# EAGLE schematic dsp_board_dds_vga (EAGLE 9.6.2)
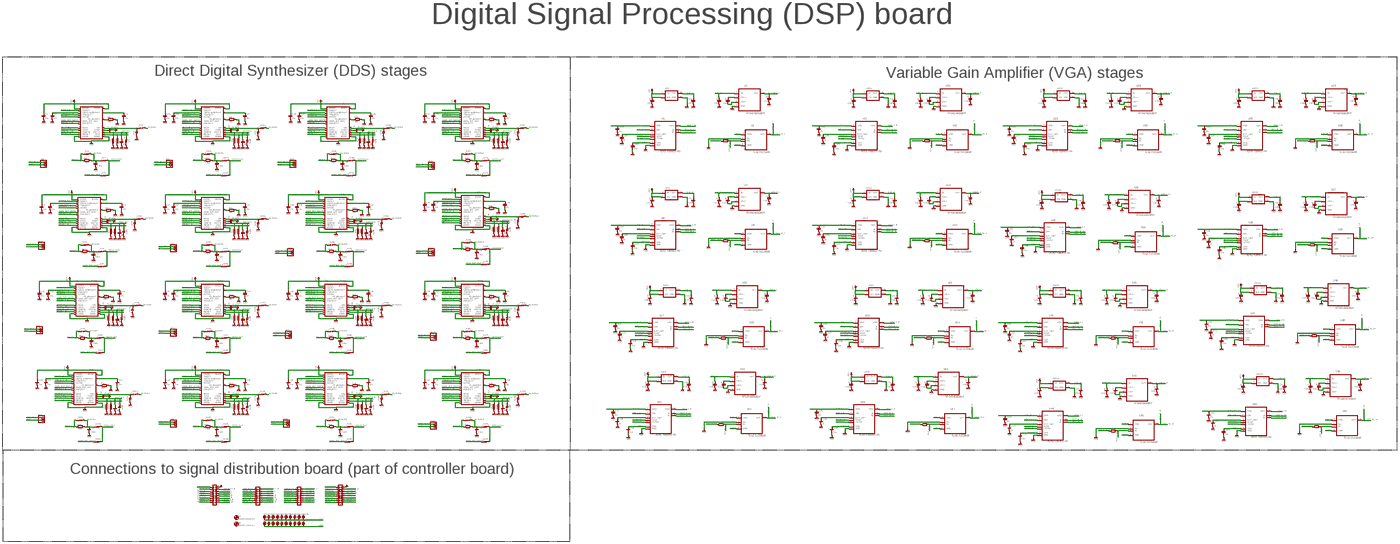
[diagram p0: schematic, sheet 1, overview]
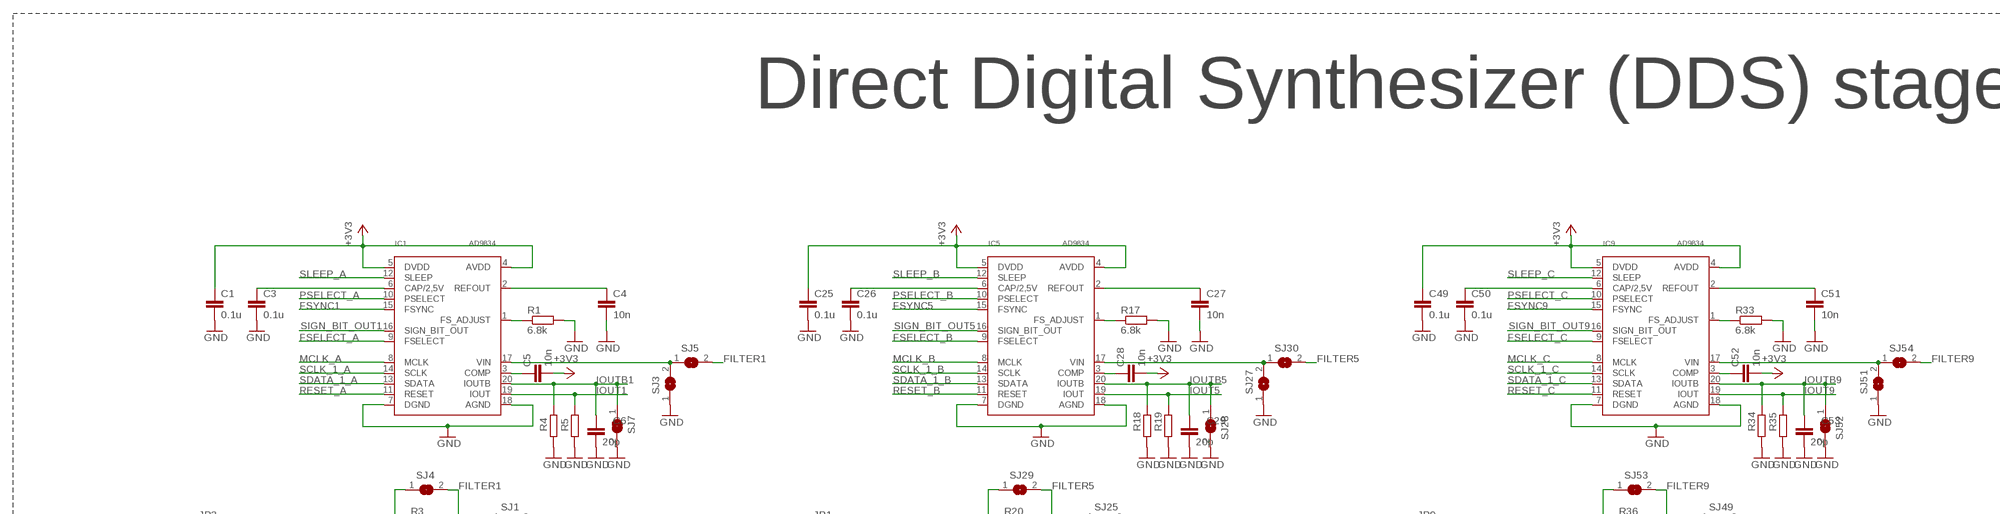
[diagram p1: schematic, sheet 1, part 1 of 7]
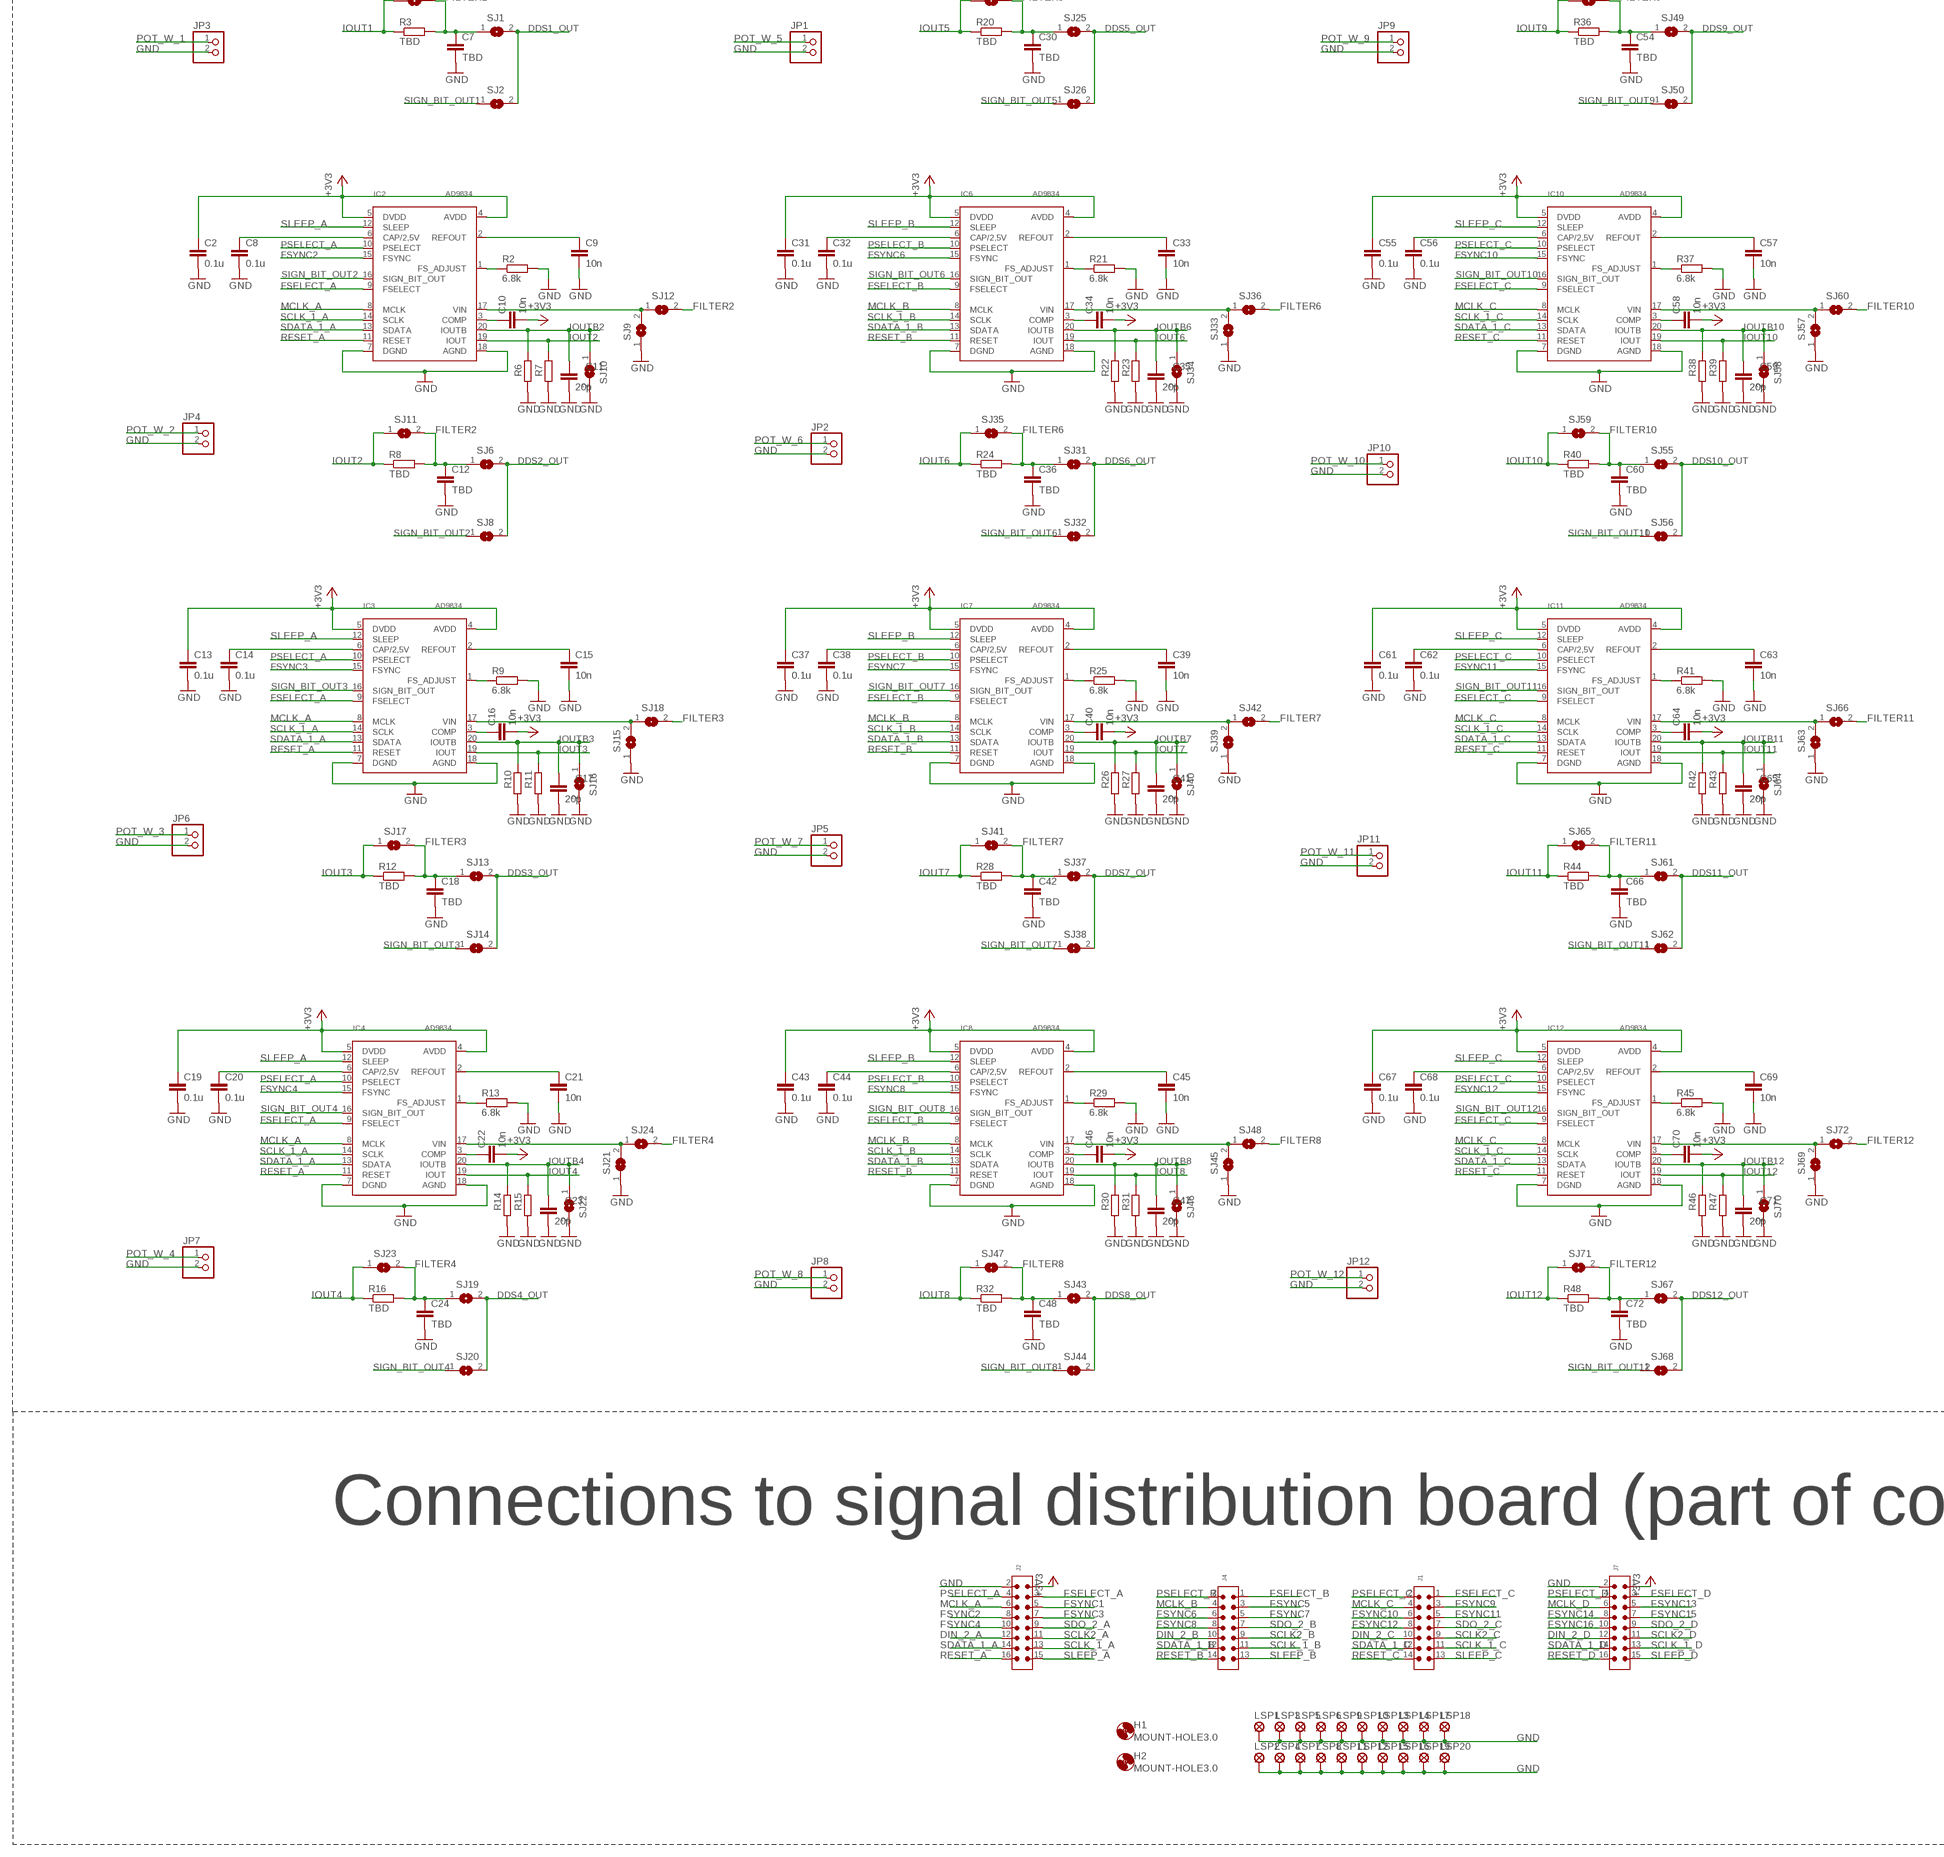
[diagram p2: schematic, sheet 1, part 2 of 7]
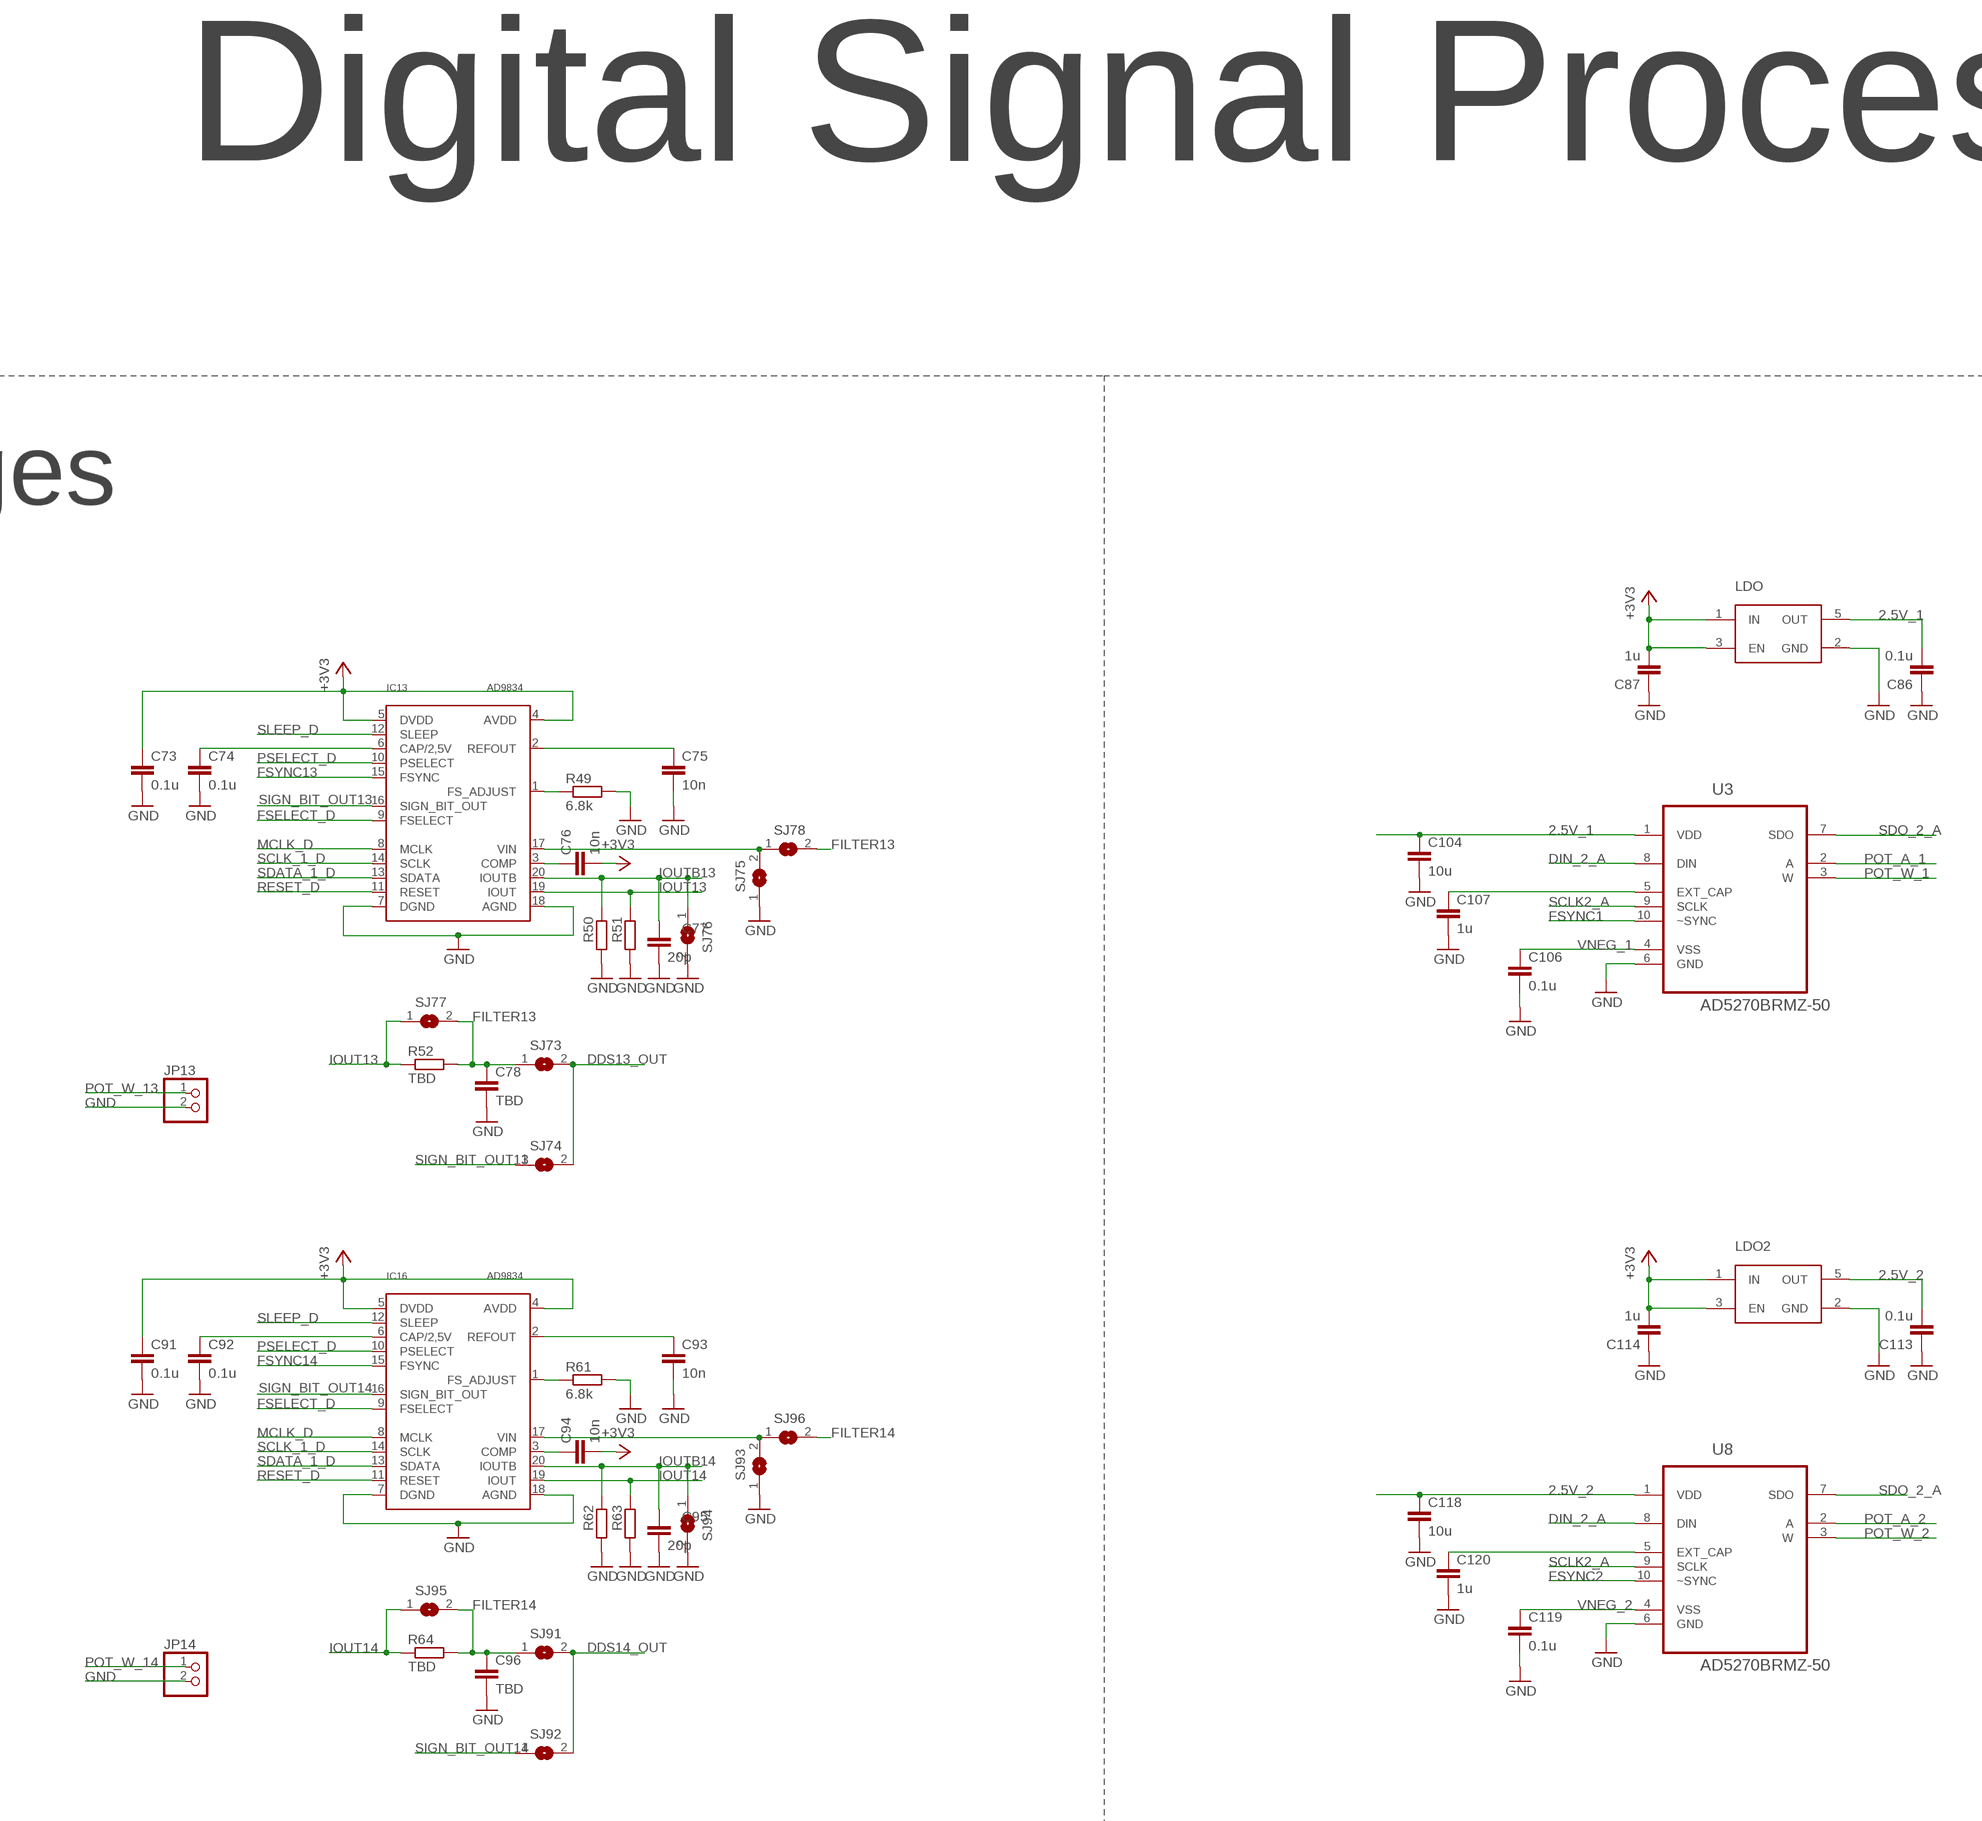
[diagram p3: schematic, sheet 1, part 3 of 7]
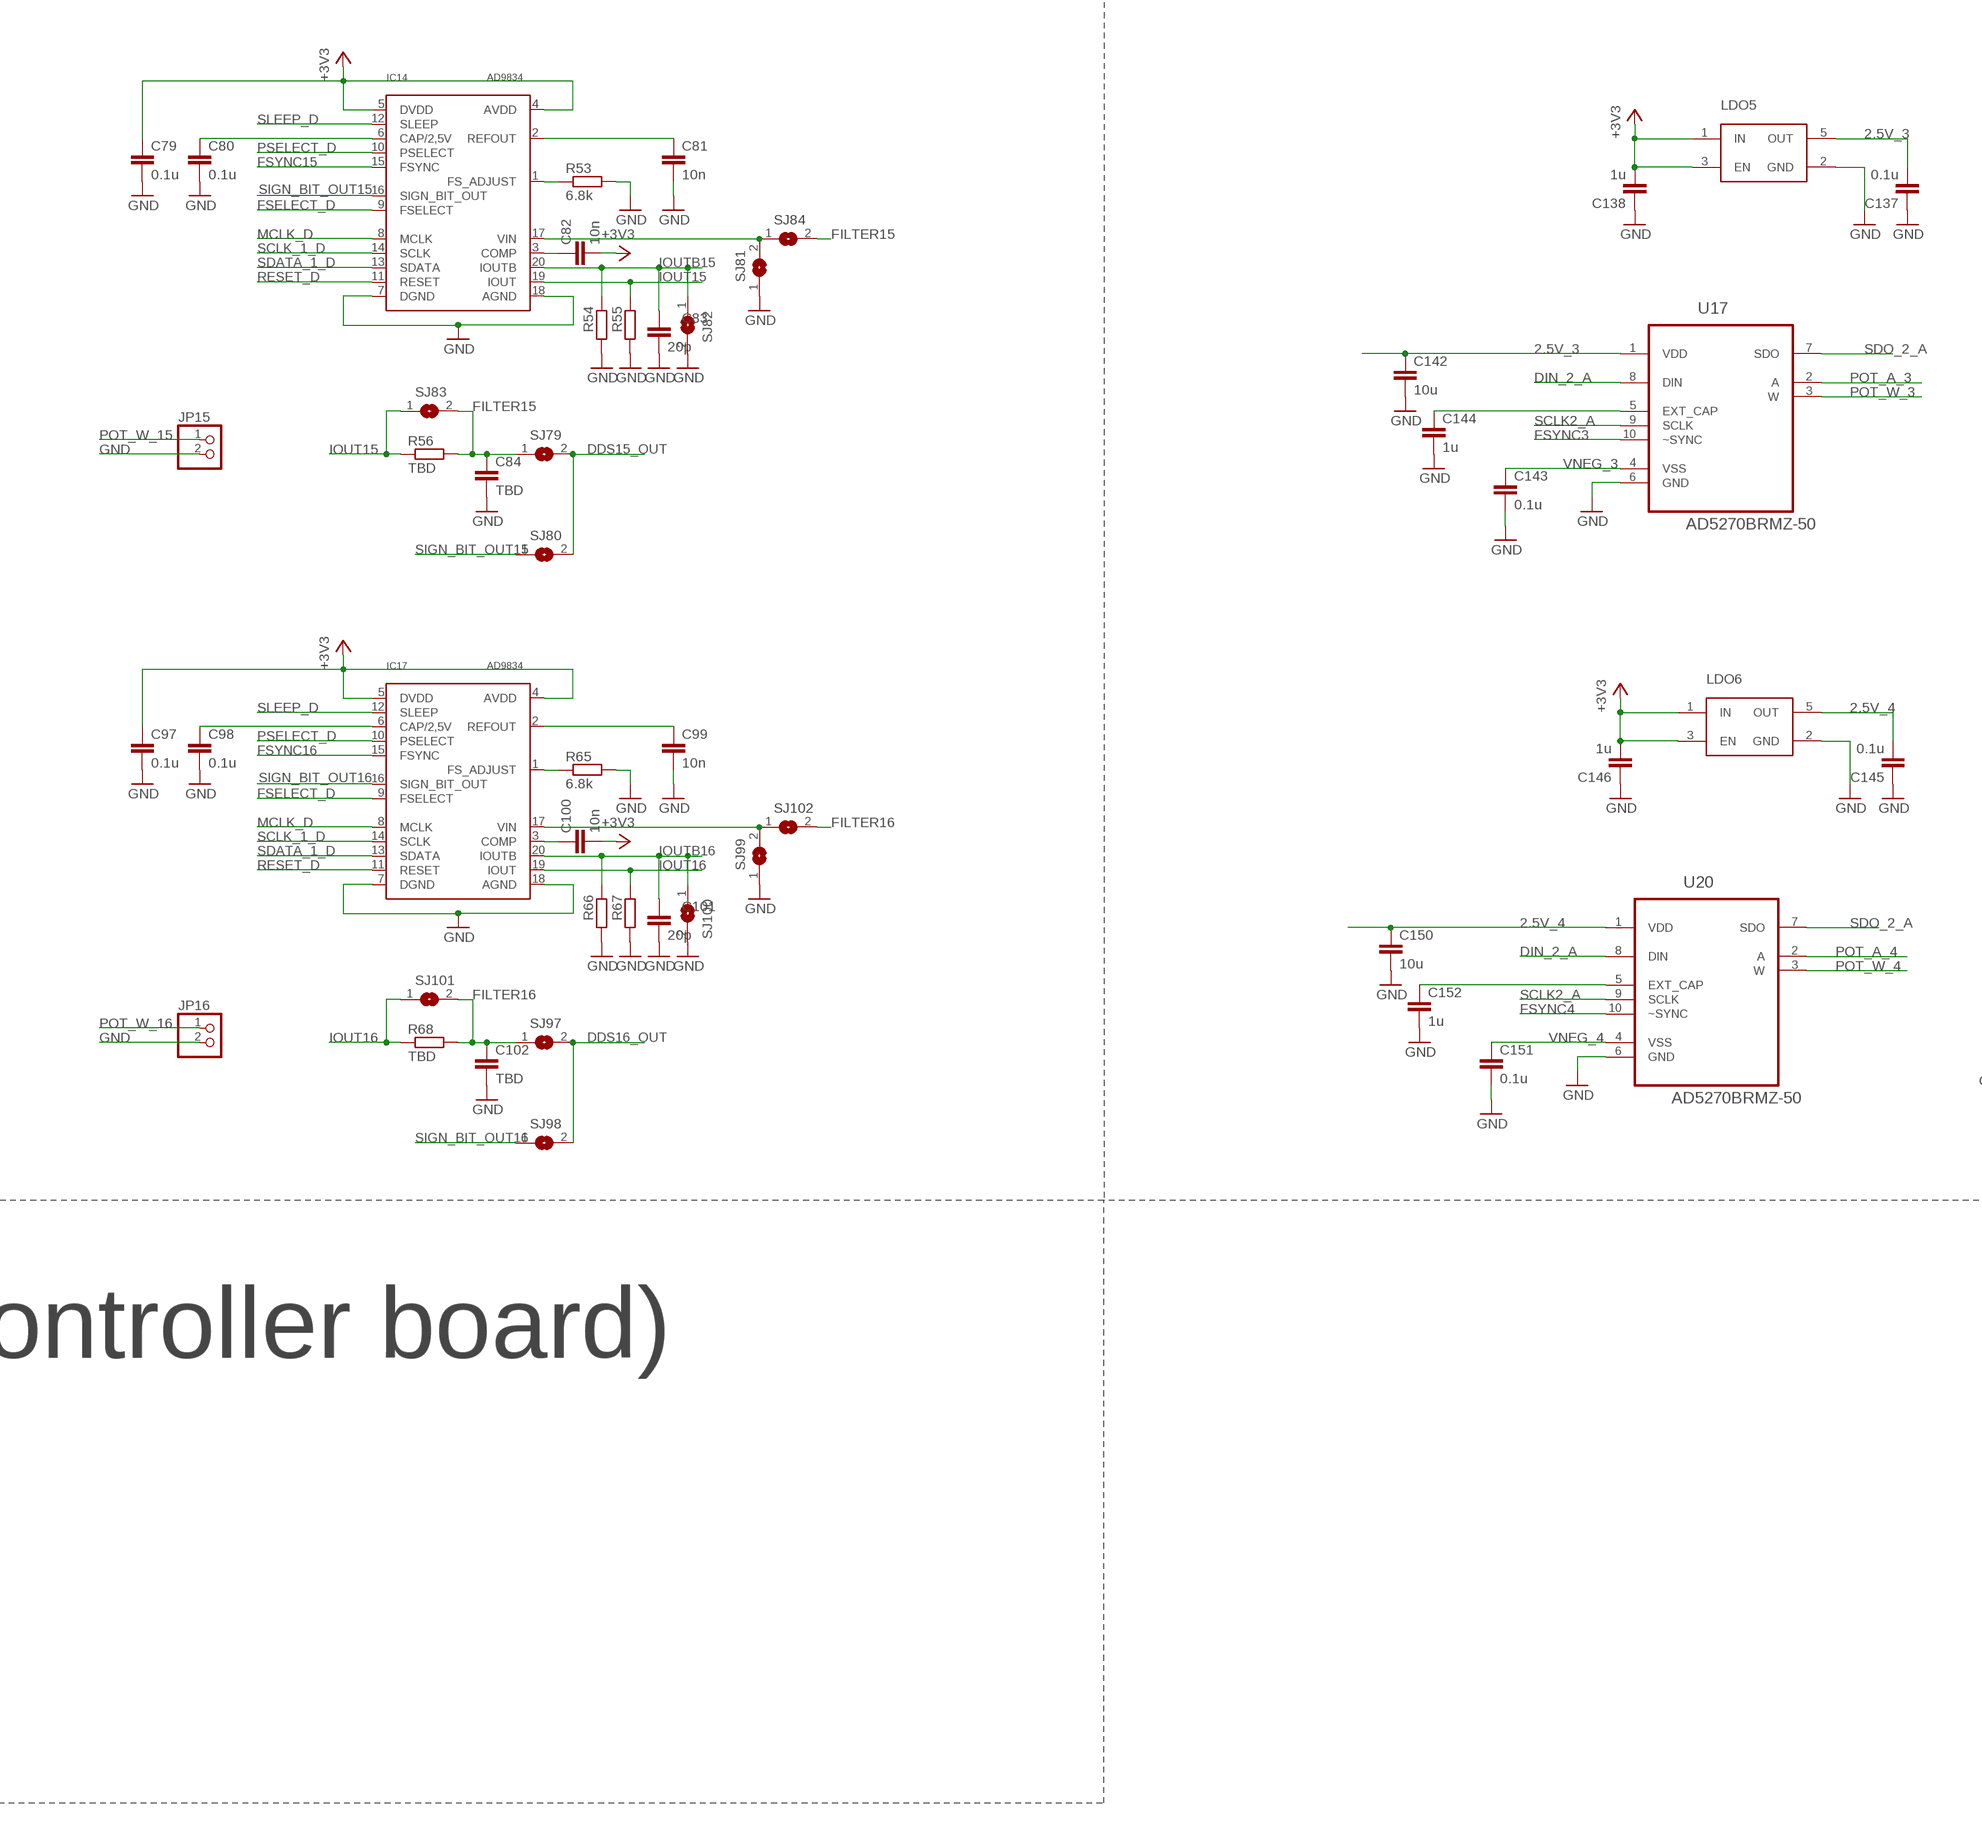
[diagram p4: schematic, sheet 1, part 4 of 7]
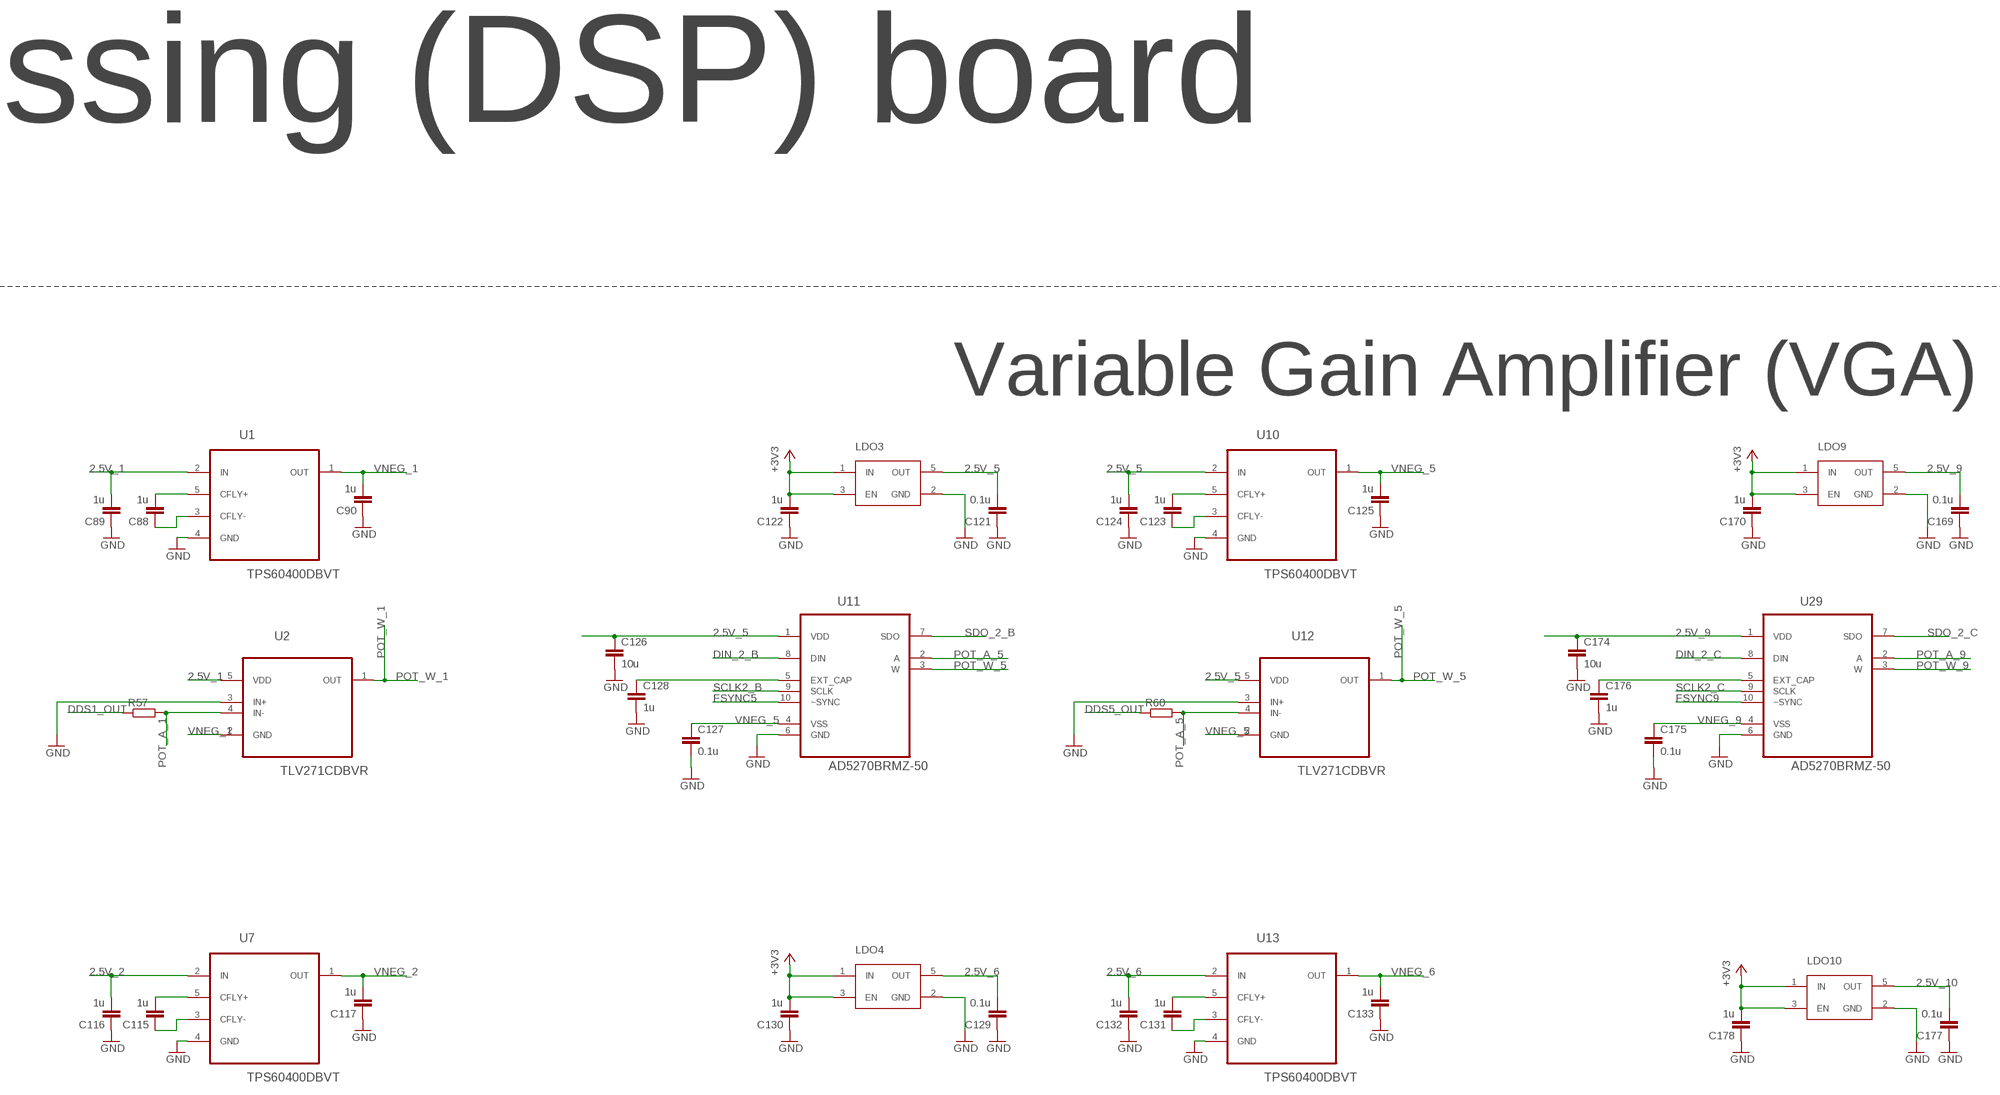
[diagram p5: schematic, sheet 1, part 5 of 7]
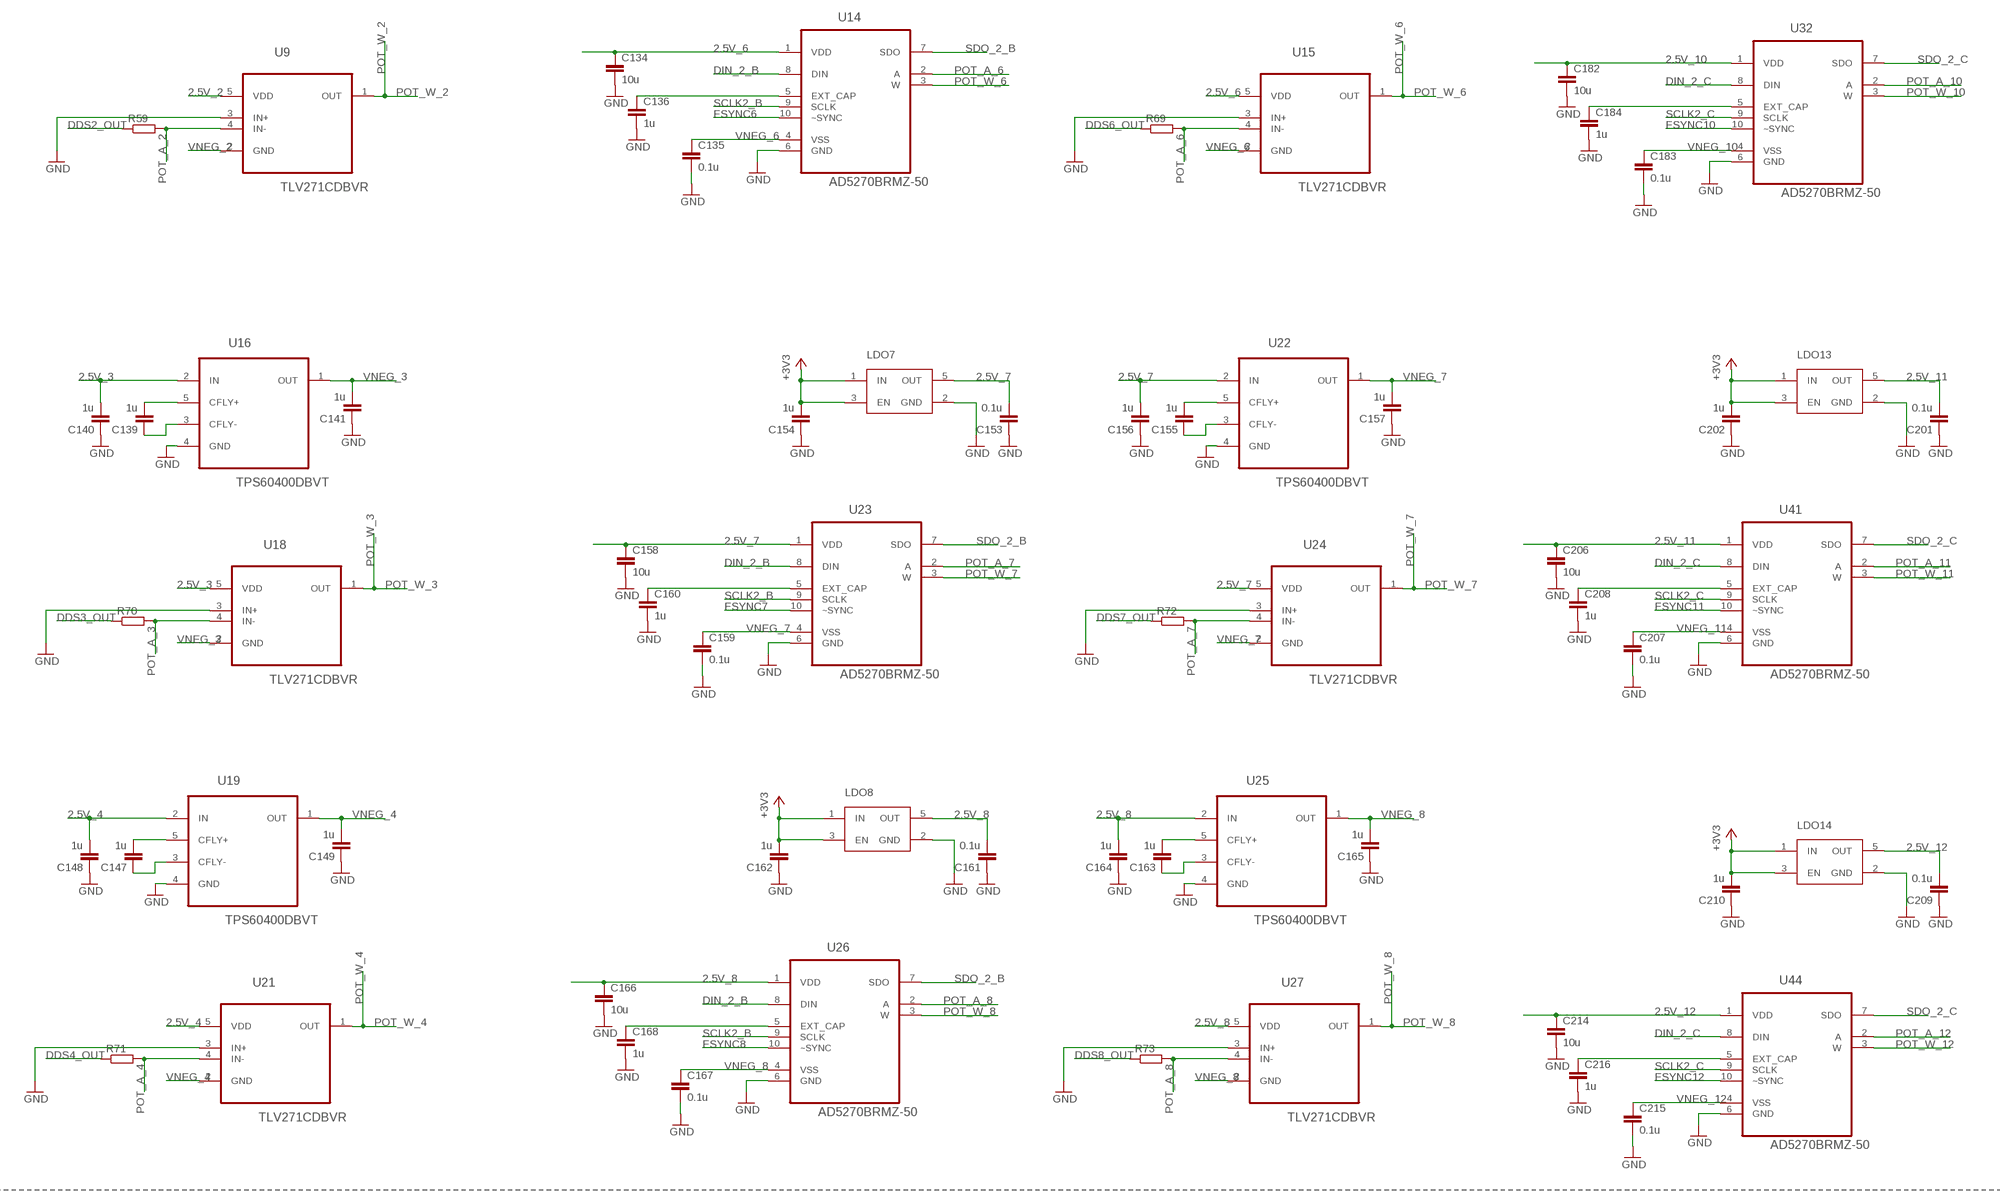
[diagram p6: schematic, sheet 1, part 6 of 7]
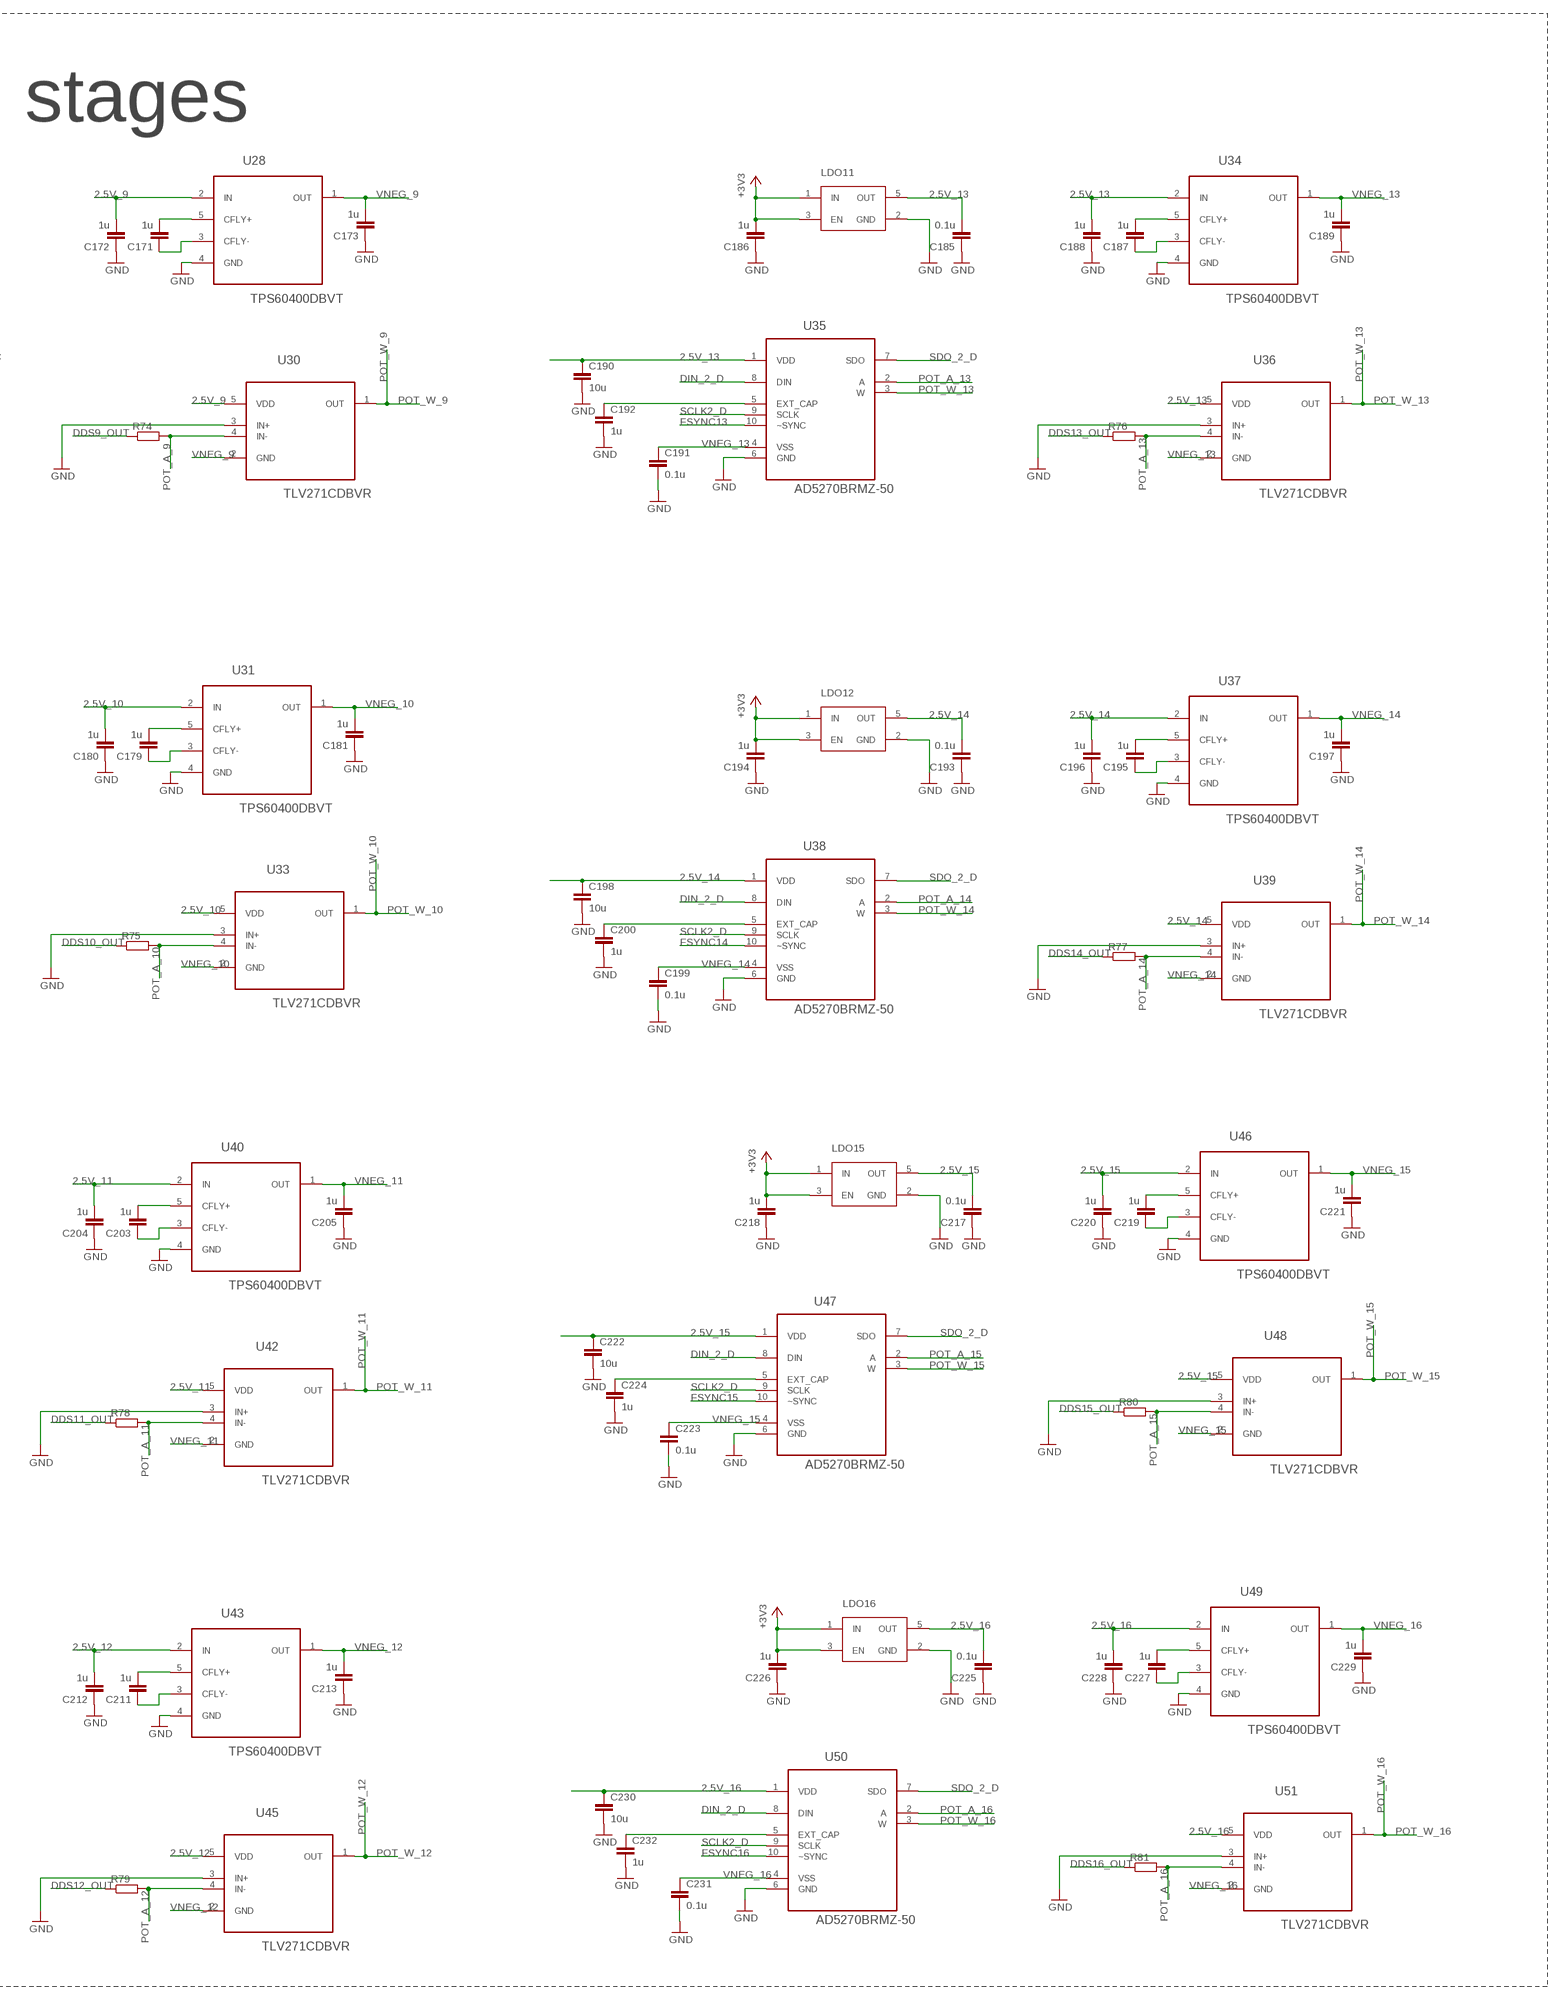
[diagram p7: schematic, sheet 1, part 7 of 7]

## Parts
C1  0.1u  C-EUC0603  [C0603]
C2  0.1u  C-EUC0603  [C0603]
C3  0.1u  C-EUC0603  [C0603]
C4  10n  C-EUC0603  [C0603]
C5  10n  C-EUC0603  [C0603]
C6  20p  C-EUC0603  [C0603]
C7  TBD  C-EUC0603  [C0603]
C8  0.1u  C-EUC0603  [C0603]
C9  10n  C-EUC0603  [C0603]
C10  10n  C-EUC0603  [C0603]
C11  20p  C-EUC0603  [C0603]
C12  TBD  C-EUC0603  [C0603]
C13  0.1u  C-EUC0603  [C0603]
C14  0.1u  C-EUC0603  [C0603]
C15  10n  C-EUC0603  [C0603]
C16  10n  C-EUC0603  [C0603]
C17  20p  C-EUC0603  [C0603]
C18  TBD  C-EUC0603  [C0603]
C19  0.1u  C-EUC0603  [C0603]
C20  0.1u  C-EUC0603  [C0603]
C21  10n  C-EUC0603  [C0603]
C22  10n  C-EUC0603  [C0603]
C23  20p  C-EUC0603  [C0603]
C24  TBD  C-EUC0603  [C0603]
C25  0.1u  C-EUC0603  [C0603]
C26  0.1u  C-EUC0603  [C0603]
C27  10n  C-EUC0603  [C0603]
C28  10n  C-EUC0603  [C0603]
C29  20p  C-EUC0603  [C0603]
C30  TBD  C-EUC0603  [C0603]
C31  0.1u  C-EUC0603  [C0603]
C32  0.1u  C-EUC0603  [C0603]
C33  10n  C-EUC0603  [C0603]
C34  10n  C-EUC0603  [C0603]
C35  20p  C-EUC0603  [C0603]
C36  TBD  C-EUC0603  [C0603]
C37  0.1u  C-EUC0603  [C0603]
C38  0.1u  C-EUC0603  [C0603]
C39  10n  C-EUC0603  [C0603]
C40  10n  C-EUC0603  [C0603]
C41  20p  C-EUC0603  [C0603]
C42  TBD  C-EUC0603  [C0603]
C43  0.1u  C-EUC0603  [C0603]
C44  0.1u  C-EUC0603  [C0603]
C45  10n  C-EUC0603  [C0603]
C46  10n  C-EUC0603  [C0603]
C47  20p  C-EUC0603  [C0603]
C48  TBD  C-EUC0603  [C0603]
C49  0.1u  C-EUC0603  [C0603]
C50  0.1u  C-EUC0603  [C0603]
C51  10n  C-EUC0603  [C0603]
C52  10n  C-EUC0603  [C0603]
C53  20p  C-EUC0603  [C0603]
C54  TBD  C-EUC0603  [C0603]
C55  0.1u  C-EUC0603  [C0603]
C56  0.1u  C-EUC0603  [C0603]
C57  10n  C-EUC0603  [C0603]
C58  10n  C-EUC0603  [C0603]
C59  20p  C-EUC0603  [C0603]
C60  TBD  C-EUC0603  [C0603]
C61  0.1u  C-EUC0603  [C0603]
C62  0.1u  C-EUC0603  [C0603]
C63  10n  C-EUC0603  [C0603]
C64  10n  C-EUC0603  [C0603]
C65  20p  C-EUC0603  [C0603]
C66  TBD  C-EUC0603  [C0603]
C67  0.1u  C-EUC0603  [C0603]
C68  0.1u  C-EUC0603  [C0603]
C69  10n  C-EUC0603  [C0603]
C70  10n  C-EUC0603  [C0603]
C71  20p  C-EUC0603  [C0603]
C72  TBD  C-EUC0603  [C0603]
C73  0.1u  C-EUC0603  [C0603]
C74  0.1u  C-EUC0603  [C0603]
C75  10n  C-EUC0603  [C0603]
C76  10n  C-EUC0603  [C0603]
C77  20p  C-EUC0603  [C0603]
C78  TBD  C-EUC0603  [C0603]
C79  0.1u  C-EUC0603  [C0603]
C80  0.1u  C-EUC0603  [C0603]
C81  10n  C-EUC0603  [C0603]
C82  10n  C-EUC0603  [C0603]
C83  20p  C-EUC0603  [C0603]
C84  TBD  C-EUC0603  [C0603]
C86  0.1u  C-EUC0603  [C0603]
C87  1u  C-EUC0603  [C0603]
C88  1u  C-EUC0603  [C0603]
C89  1u  C-EUC0603  [C0603]
C90  1u  C-EUC0603  [C0603]
C91  0.1u  C-EUC0603  [C0603]
C92  0.1u  C-EUC0603  [C0603]
C93  10n  C-EUC0603  [C0603]
C94  10n  C-EUC0603  [C0603]
C95  20p  C-EUC0603  [C0603]
C96  TBD  C-EUC0603  [C0603]
C97  0.1u  C-EUC0603  [C0603]
C98  0.1u  C-EUC0603  [C0603]
C99  10n  C-EUC0603  [C0603]
C100  10n  C-EUC0603  [C0603]
C101  20p  C-EUC0603  [C0603]
C102  TBD  C-EUC0603  [C0603]
C104  10u  C-EUC0805  [C0805]
C106  0.1u  C-EUC0603  [C0603]
C107  1u  C-EUC0603  [C0603]
C113  0.1u  C-EUC0603  [C0603]
C114  1u  C-EUC0603  [C0603]
C115  1u  C-EUC0603  [C0603]
C116  1u  C-EUC0603  [C0603]
C117  1u  C-EUC0603  [C0603]
C118  10u  C-EUC0805  [C0805]
C119  0.1u  C-EUC0603  [C0603]
C120  1u  C-EUC0603  [C0603]
C121  0.1u  C-EUC0603  [C0603]
C122  1u  C-EUC0603  [C0603]
C123  1u  C-EUC0603  [C0603]
C124  1u  C-EUC0603  [C0603]
C125  1u  C-EUC0603  [C0603]
C126  10u  C-EUC0805  [C0805]
C127  0.1u  C-EUC0603  [C0603]
C128  1u  C-EUC0603  [C0603]
C129  0.1u  C-EUC0603  [C0603]
C130  1u  C-EUC0603  [C0603]
C131  1u  C-EUC0603  [C0603]
C132  1u  C-EUC0603  [C0603]
C133  1u  C-EUC0603  [C0603]
C134  10u  C-EUC0805  [C0805]
C135  0.1u  C-EUC0603  [C0603]
C136  1u  C-EUC0603  [C0603]
C137  0.1u  C-EUC0603  [C0603]
C138  1u  C-EUC0603  [C0603]
C139  1u  C-EUC0603  [C0603]
C140  1u  C-EUC0603  [C0603]
C141  1u  C-EUC0603  [C0603]
C142  10u  C-EUC0805  [C0805]
C143  0.1u  C-EUC0603  [C0603]
C144  1u  C-EUC0603  [C0603]
C145  0.1u  C-EUC0603  [C0603]
C146  1u  C-EUC0603  [C0603]
C147  1u  C-EUC0603  [C0603]
C148  1u  C-EUC0603  [C0603]
C149  1u  C-EUC0603  [C0603]
C150  10u  C-EUC0805  [C0805]
C151  0.1u  C-EUC0603  [C0603]
C152  1u  C-EUC0603  [C0603]
C153  0.1u  C-EUC0603  [C0603]
C154  1u  C-EUC0603  [C0603]
C155  1u  C-EUC0603  [C0603]
C156  1u  C-EUC0603  [C0603]
C157  1u  C-EUC0603  [C0603]
C158  10u  C-EUC0805  [C0805]
C159  0.1u  C-EUC0603  [C0603]
C160  1u  C-EUC0603  [C0603]
C161  0.1u  C-EUC0603  [C0603]
C162  1u  C-EUC0603  [C0603]
C163  1u  C-EUC0603  [C0603]
C164  1u  C-EUC0603  [C0603]
C165  1u  C-EUC0603  [C0603]
C166  10u  C-EUC0805  [C0805]
C167  0.1u  C-EUC0603  [C0603]
C168  1u  C-EUC0603  [C0603]
C169  0.1u  C-EUC0603  [C0603]
C170  1u  C-EUC0603  [C0603]
C171  1u  C-EUC0603  [C0603]
C172  1u  C-EUC0603  [C0603]
C173  1u  C-EUC0603  [C0603]
C174  10u  C-EUC0805  [C0805]
C175  0.1u  C-EUC0603  [C0603]
C176  1u  C-EUC0603  [C0603]
C177  0.1u  C-EUC0603  [C0603]
C178  1u  C-EUC0603  [C0603]
C179  1u  C-EUC0603  [C0603]
C180  1u  C-EUC0603  [C0603]
C181  1u  C-EUC0603  [C0603]
C182  10u  C-EUC0805  [C0805]
C183  0.1u  C-EUC0603  [C0603]
C184  1u  C-EUC0603  [C0603]
C185  0.1u  C-EUC0603  [C0603]
C186  1u  C-EUC0603  [C0603]
C187  1u  C-EUC0603  [C0603]
C188  1u  C-EUC0603  [C0603]
C189  1u  C-EUC0603  [C0603]
C190  10u  C-EUC0805  [C0805]
C191  0.1u  C-EUC0603  [C0603]
C192  1u  C-EUC0603  [C0603]
C193  0.1u  C-EUC0603  [C0603]
C194  1u  C-EUC0603  [C0603]
C195  1u  C-EUC0603  [C0603]
C196  1u  C-EUC0603  [C0603]
C197  1u  C-EUC0603  [C0603]
C198  10u  C-EUC0805  [C0805]
C199  0.1u  C-EUC0603  [C0603]
C200  1u  C-EUC0603  [C0603]
C201  0.1u  C-EUC0603  [C0603]
C202  1u  C-EUC0603  [C0603]
C203  1u  C-EUC0603  [C0603]
C204  1u  C-EUC0603  [C0603]
C205  1u  C-EUC0603  [C0603]
C206  10u  C-EUC0805  [C0805]
C207  0.1u  C-EUC0603  [C0603]
C208  1u  C-EUC0603  [C0603]
C209  0.1u  C-EUC0603  [C0603]
C210  1u  C-EUC0603  [C0603]
C211  1u  C-EUC0603  [C0603]
C212  1u  C-EUC0603  [C0603]
C213  1u  C-EUC0603  [C0603]
C214  10u  C-EUC0805  [C0805]
C215  0.1u  C-EUC0603  [C0603]
C216  1u  C-EUC0603  [C0603]
C217  0.1u  C-EUC0603  [C0603]
C218  1u  C-EUC0603  [C0603]
C219  1u  C-EUC0603  [C0603]
C220  1u  C-EUC0603  [C0603]
C221  1u  C-EUC0603  [C0603]
C222  10u  C-EUC0805  [C0805]
C223  0.1u  C-EUC0603  [C0603]
C224  1u  C-EUC0603  [C0603]
C225  0.1u  C-EUC0603  [C0603]
C226  1u  C-EUC0603  [C0603]
C227  1u  C-EUC0603  [C0603]
C228  1u  C-EUC0603  [C0603]
C229  1u  C-EUC0603  [C0603]
C230  10u  C-EUC0805  [C0805]
C231  0.1u  C-EUC0603  [C0603]
C232  1u  C-EUC0603  [C0603]
H1  MOUNT-HOLE3.0  [3,0]
H2  MOUNT-HOLE3.0  [3,0]
IC1  AD9834  [TSSOP20]
IC2  AD9834  [TSSOP20]
IC3  AD9834  [TSSOP20]
IC4  AD9834  [TSSOP20]
IC5  AD9834  [TSSOP20]
IC6  AD9834  [TSSOP20]
IC7  AD9834  [TSSOP20]
IC8  AD9834  [TSSOP20]
IC9  AD9834  [TSSOP20]
IC10  AD9834  [TSSOP20]
IC11  AD9834  [TSSOP20]
IC12  AD9834  [TSSOP20]
IC13  AD9834  [TSSOP20]
IC14  AD9834  [TSSOP20]
IC16  AD9834  [TSSOP20]
IC17  AD9834  [TSSOP20]
J1  6130XX21021_61301421021  [61301421021]
J2  6130XX21021_61301621021  [61301621021]
J4  6130XX21021_61301421021  [61301421021]
J7  6130XX21021_61301621021  [61301621021]
JP1  PINHD-1X2  [1X02]
JP2  PINHD-1X2  [1X02]
JP3  PINHD-1X2  [1X02]
JP4  PINHD-1X2  [1X02]
JP5  PINHD-1X2  [1X02]
JP6  PINHD-1X2  [1X02]
JP7  PINHD-1X2  [1X02]
JP8  PINHD-1X2  [1X02]
JP9  PINHD-1X2  [1X02]
JP10  PINHD-1X2  [1X02]
JP11  PINHD-1X2  [1X02]
JP12  PINHD-1X2  [1X02]
JP13  PINHD-1X2  [1X02]
JP14  PINHD-1X2  [1X02]
JP15  PINHD-1X2  [1X02]
JP16  PINHD-1X2  [1X02]
LDO  TLV75525PDBVR  [SOT95P280X145-5N]
LDO2  TLV75525PDBVR  [SOT95P280X145-5N]
LDO3  TLV75525PDBVR  [SOT95P280X145-5N]
LDO4  TLV75525PDBVR  [SOT95P280X145-5N]
LDO5  TLV75525PDBVR  [SOT95P280X145-5N]
LDO6  TLV75525PDBVR  [SOT95P280X145-5N]
LDO7  TLV75525PDBVR  [SOT95P280X145-5N]
LDO8  TLV75525PDBVR  [SOT95P280X145-5N]
LDO9  TLV75525PDBVR  [SOT95P280X145-5N]
LDO10  TLV75525PDBVR  [SOT95P280X145-5N]
LDO11  TLV75525PDBVR  [SOT95P280X145-5N]
LDO12  TLV75525PDBVR  [SOT95P280X145-5N]
LDO13  TLV75525PDBVR  [SOT95P280X145-5N]
LDO14  TLV75525PDBVR  [SOT95P280X145-5N]
LDO15  TLV75525PDBVR  [SOT95P280X145-5N]
LDO16  TLV75525PDBVR  [SOT95P280X145-5N]
LSP1  LSP10  [LSP10]
LSP2  LSP10  [LSP10]
LSP3  LSP10  [LSP10]
LSP4  LSP10  [LSP10]
LSP5  LSP10  [LSP10]
LSP6  LSP10  [LSP10]
LSP7  LSP10  [LSP10]
LSP8  LSP10  [LSP10]
LSP9  LSP10  [LSP10]
LSP10  LSP10  [LSP10]
LSP11  LSP10  [LSP10]
LSP12  LSP10  [LSP10]
LSP13  LSP10  [LSP10]
LSP14  LSP10  [LSP10]
LSP15  LSP10  [LSP10]
LSP16  LSP10  [LSP10]
LSP17  LSP10  [LSP10]
LSP18  LSP10  [LSP10]
LSP19  LSP10  [LSP10]
LSP20  LSP10  [LSP10]
R1  6.8k  R-EU_R0603  [R0603]
R2  6.8k  R-EU_R0603  [R0603]
R3  TBD  R-EU_R0603  [R0603]
R4  200  R-EU_R0603  [R0603]
R5  200  R-EU_R0603  [R0603]
R6  200  R-EU_R0603  [R0603]
R7  200  R-EU_R0603  [R0603]
R8  TBD  R-EU_R0603  [R0603]
R9  6.8k  R-EU_R0603  [R0603]
R10  200  R-EU_R0603  [R0603]
R11  200  R-EU_R0603  [R0603]
R12  TBD  R-EU_R0603  [R0603]
R13  6.8k  R-EU_R0603  [R0603]
R14  200  R-EU_R0603  [R0603]
R15  200  R-EU_R0603  [R0603]
R16  TBD  R-EU_R0603  [R0603]
R17  6.8k  R-EU_R0603  [R0603]
R18  200  R-EU_R0603  [R0603]
R19  200  R-EU_R0603  [R0603]
R20  TBD  R-EU_R0603  [R0603]
R21  6.8k  R-EU_R0603  [R0603]
R22  200  R-EU_R0603  [R0603]
R23  200  R-EU_R0603  [R0603]
R24  TBD  R-EU_R0603  [R0603]
R25  6.8k  R-EU_R0603  [R0603]
R26  200  R-EU_R0603  [R0603]
R27  200  R-EU_R0603  [R0603]
R28  TBD  R-EU_R0603  [R0603]
R29  6.8k  R-EU_R0603  [R0603]
R30  200  R-EU_R0603  [R0603]
R31  200  R-EU_R0603  [R0603]
R32  TBD  R-EU_R0603  [R0603]
R33  6.8k  R-EU_R0603  [R0603]
R34  200  R-EU_R0603  [R0603]
R35  200  R-EU_R0603  [R0603]
R36  TBD  R-EU_R0603  [R0603]
R37  6.8k  R-EU_R0603  [R0603]
R38  200  R-EU_R0603  [R0603]
R39  200  R-EU_R0603  [R0603]
R40  TBD  R-EU_R0603  [R0603]
R41  6.8k  R-EU_R0603  [R0603]
R42  200  R-EU_R0603  [R0603]
R43  200  R-EU_R0603  [R0603]
R44  TBD  R-EU_R0603  [R0603]
R45  6.8k  R-EU_R0603  [R0603]
R46  200  R-EU_R0603  [R0603]
R47  200  R-EU_R0603  [R0603]
R48  TBD  R-EU_R0603  [R0603]
R49  6.8k  R-EU_R0603  [R0603]
R50  200  R-EU_R0603  [R0603]
R51  200  R-EU_R0603  [R0603]
R52  TBD  R-EU_R0603  [R0603]
R53  6.8k  R-EU_R0603  [R0603]
R54  200  R-EU_R0603  [R0603]
R55  200  R-EU_R0603  [R0603]
R56  TBD  R-EU_R0603  [R0603]
R57  R-EU_R0603  [R0603]
R59  R-EU_R0603  [R0603]
R60  R-EU_R0603  [R0603]
R61  6.8k  R-EU_R0603  [R0603]
R62  200  R-EU_R0603  [R0603]
R63  200  R-EU_R0603  [R0603]
R64  TBD  R-EU_R0603  [R0603]
R65  6.8k  R-EU_R0603  [R0603]
R66  200  R-EU_R0603  [R0603]
R67  200  R-EU_R0603  [R0603]
R68  TBD  R-EU_R0603  [R0603]
R69  R-EU_R0603  [R0603]
R70  R-EU_R0603  [R0603]
R71  R-EU_R0603  [R0603]
R72  R-EU_R0603  [R0603]
R73  R-EU_R0603  [R0603]
R74  R-EU_R0603  [R0603]
R75  R-EU_R0603  [R0603]
R76  R-EU_R0603  [R0603]
R77  R-EU_R0603  [R0603]
R78  R-EU_R0603  [R0603]
R79  R-EU_R0603  [R0603]
R80  R-EU_R0603  [R0603]
R81  R-EU_R0603  [R0603]
SJ1  SJ  [SJ]
SJ2  SJ  [SJ]
SJ3  SJ  [SJ]
SJ4  SJ  [SJ]
SJ5  SJ  [SJ]
SJ6  SJ  [SJ]
SJ7  SJ  [SJ]
SJ8  SJ  [SJ]
SJ9  SJ  [SJ]
SJ10  SJ  [SJ]
SJ11  SJ  [SJ]
SJ12  SJ  [SJ]
SJ13  SJ  [SJ]
SJ14  SJ  [SJ]
SJ15  SJ  [SJ]
SJ16  SJ  [SJ]
SJ17  SJ  [SJ]
SJ18  SJ  [SJ]
SJ19  SJ  [SJ]
SJ20  SJ  [SJ]
SJ21  SJ  [SJ]
SJ22  SJ  [SJ]
SJ23  SJ  [SJ]
SJ24  SJ  [SJ]
SJ25  SJ  [SJ]
SJ26  SJ  [SJ]
SJ27  SJ  [SJ]
SJ28  SJ  [SJ]
SJ29  SJ  [SJ]
SJ30  SJ  [SJ]
SJ31  SJ  [SJ]
SJ32  SJ  [SJ]
SJ33  SJ  [SJ]
SJ34  SJ  [SJ]
SJ35  SJ  [SJ]
SJ36  SJ  [SJ]
SJ37  SJ  [SJ]
SJ38  SJ  [SJ]
SJ39  SJ  [SJ]
SJ40  SJ  [SJ]
SJ41  SJ  [SJ]
SJ42  SJ  [SJ]
SJ43  SJ  [SJ]
SJ44  SJ  [SJ]
SJ45  SJ  [SJ]
SJ46  SJ  [SJ]
SJ47  SJ  [SJ]
SJ48  SJ  [SJ]
SJ49  SJ  [SJ]
SJ50  SJ  [SJ]
SJ51  SJ  [SJ]
SJ52  SJ  [SJ]
SJ53  SJ  [SJ]
SJ54  SJ  [SJ]
SJ55  SJ  [SJ]
SJ56  SJ  [SJ]
SJ57  SJ  [SJ]
SJ58  SJ  [SJ]
SJ59  SJ  [SJ]
SJ60  SJ  [SJ]
SJ61  SJ  [SJ]
SJ62  SJ  [SJ]
SJ63  SJ  [SJ]
SJ64  SJ  [SJ]
SJ65  SJ  [SJ]
SJ66  SJ  [SJ]
SJ67  SJ  [SJ]
SJ68  SJ  [SJ]
SJ69  SJ  [SJ]
SJ70  SJ  [SJ]
SJ71  SJ  [SJ]
SJ72  SJ  [SJ]
SJ73  SJ  [SJ]
SJ74  SJ  [SJ]
SJ75  SJ  [SJ]
SJ76  SJ  [SJ]
SJ77  SJ  [SJ]
SJ78  SJ  [SJ]
SJ79  SJ  [SJ]
SJ80  SJ  [SJ]
SJ81  SJ  [SJ]
SJ82  SJ  [SJ]
SJ83  SJ  [SJ]
SJ84  SJ  [SJ]
SJ91  SJ  [SJ]
SJ92  SJ  [SJ]
SJ93  SJ  [SJ]
SJ94  SJ  [SJ]
SJ95  SJ  [SJ]
SJ96  SJ  [SJ]
SJ97  SJ  [SJ]
SJ98  SJ  [SJ]
SJ99  SJ  [SJ]
SJ100  SJ  [SJ]
SJ101  SJ  [SJ]
SJ102  SJ  [SJ]
U1  TPS60400DBVT  [SOT95P280X145-5N]
U2  TLV271CDBVR  [SOT95P280X145-5N]
U3  AD5270BRMZ-50  [SOP50P490X110-10N]
U7  TPS60400DBVT  [SOT95P280X145-5N]
U8  AD5270BRMZ-50  [SOP50P490X110-10N]
U9  TLV271CDBVR  [SOT95P280X145-5N]
U10  TPS60400DBVT  [SOT95P280X145-5N]
U11  AD5270BRMZ-50  [SOP50P490X110-10N]
U12  TLV271CDBVR  [SOT95P280X145-5N]
U13  TPS60400DBVT  [SOT95P280X145-5N]
U14  AD5270BRMZ-50  [SOP50P490X110-10N]
U15  TLV271CDBVR  [SOT95P280X145-5N]
U16  TPS60400DBVT  [SOT95P280X145-5N]
U17  AD5270BRMZ-50  [SOP50P490X110-10N]
U18  TLV271CDBVR  [SOT95P280X145-5N]
U19  TPS60400DBVT  [SOT95P280X145-5N]
U20  AD5270BRMZ-50  [SOP50P490X110-10N]
U21  TLV271CDBVR  [SOT95P280X145-5N]
U22  TPS60400DBVT  [SOT95P280X145-5N]
U23  AD5270BRMZ-50  [SOP50P490X110-10N]
U24  TLV271CDBVR  [SOT95P280X145-5N]
U25  TPS60400DBVT  [SOT95P280X145-5N]
U26  AD5270BRMZ-50  [SOP50P490X110-10N]
U27  TLV271CDBVR  [SOT95P280X145-5N]
U28  TPS60400DBVT  [SOT95P280X145-5N]
U29  AD5270BRMZ-50  [SOP50P490X110-10N]
U30  TLV271CDBVR  [SOT95P280X145-5N]
U31  TPS60400DBVT  [SOT95P280X145-5N]
U32  AD5270BRMZ-50  [SOP50P490X110-10N]
U33  TLV271CDBVR  [SOT95P280X145-5N]
U34  TPS60400DBVT  [SOT95P280X145-5N]
U35  AD5270BRMZ-50  [SOP50P490X110-10N]
U36  TLV271CDBVR  [SOT95P280X145-5N]
U37  TPS60400DBVT  [SOT95P280X145-5N]
U38  AD5270BRMZ-50  [SOP50P490X110-10N]
U39  TLV271CDBVR  [SOT95P280X145-5N]
U40  TPS60400DBVT  [SOT95P280X145-5N]
U41  AD5270BRMZ-50  [SOP50P490X110-10N]
U42  TLV271CDBVR  [SOT95P280X145-5N]
U43  TPS60400DBVT  [SOT95P280X145-5N]
U44  AD5270BRMZ-50  [SOP50P490X110-10N]
U45  TLV271CDBVR  [SOT95P280X145-5N]
U46  TPS60400DBVT  [SOT95P280X145-5N]
U47  AD5270BRMZ-50  [SOP50P490X110-10N]
U48  TLV271CDBVR  [SOT95P280X145-5N]
U49  TPS60400DBVT  [SOT95P280X145-5N]
U50  AD5270BRMZ-50  [SOP50P490X110-10N]
U51  TLV271CDBVR  [SOT95P280X145-5N]

## Nets
2.5V_1: C86.2 C89.2 C104.1 LDO.5(OUT) U1.2(IN) U2.5(VDD) U3.1(VDD)
2.5V_2: C113.2 C116.2 C118.1 LDO2.5(OUT) U7.2(IN) U8.1(VDD) U9.5(VDD)
2.5V_3: C137.2 C140.2 C142.1 LDO5.5(OUT) U16.2(IN) U17.1(VDD) U18.5(VDD)
2.5V_4: C145.2 C148.2 C150.1 LDO6.5(OUT) U19.2(IN) U20.1(VDD) U21.5(VDD)
2.5V_5: C121.2 C124.2 C126.1 LDO3.5(OUT) U10.2(IN) U11.1(VDD) U12.5(VDD)
2.5V_6: C129.2 C132.2 C134.1 LDO4.5(OUT) U13.2(IN) U14.1(VDD) U15.5(VDD)
2.5V_7: C153.2 C156.2 C158.1 LDO7.5(OUT) U22.2(IN) U23.1(VDD) U24.5(VDD)
2.5V_8: C161.2 C164.2 C166.1 LDO8.5(OUT) U25.2(IN) U26.1(VDD) U27.5(VDD)
2.5V_9: C169.2 C172.2 C174.1 LDO9.5(OUT) U28.2(IN) U29.1(VDD) U30.5(VDD)
2.5V_10: C177.2 C180.2 C182.1 LDO10.5(OUT) U31.2(IN) U32.1(VDD) U33.5(VDD)
2.5V_11: C201.2 C204.2 C206.1 LDO13.5(OUT) U40.2(IN) U41.1(VDD) U42.5(VDD)
2.5V_12: C209.2 C212.2 C214.1 LDO14.5(OUT) U43.2(IN) U44.1(VDD) U45.5(VDD)
2.5V_13: C185.2 C188.2 C190.1 LDO11.5(OUT) U34.2(IN) U35.1(VDD) U36.5(VDD)
2.5V_14: C193.2 C196.2 C198.1 LDO12.5(OUT) U37.2(IN) U38.1(VDD) U39.5(VDD)
2.5V_15: C217.2 C220.2 C222.1 LDO15.5(OUT) U46.2(IN) U47.1(VDD) U48.5(VDD)
2.5V_16: C225.2 C228.2 C230.1 LDO16.5(OUT) U49.2(IN) U50.1(VDD) U51.5(VDD)
+3V3: C1.1 C2.1 C5.2 C10.2 C13.1 C16.2 C19.1 C22.2 C25.1 C28.2 C31.1 C34.2 C37.1 C40.2 C43.1 C46.2 C49.1 C52.2 C55.1 C58.2 C61.1 C64.2 C67.1 C70.2 C73.1 C76.2 C79.1 C82.2 C87.2 C91.1 C94.2 C97.1 C100.2 C114.2 C122.2 C130.2 C138.2 C146.2 C154.2 C162.2 C170.2 C178.2 C186.2 C194.2 C202.2 C210.2 C218.2 C226.2 IC1.4(AVDD) IC1.5(DVDD) IC2.4(AVDD) IC2.5(DVDD) IC3.4(AVDD) IC3.5(DVDD) IC4.4(AVDD) IC4.5(DVDD) IC5.4(AVDD) IC5.5(DVDD) IC6.4(AVDD) IC6.5(DVDD) IC7.4(AVDD) IC7.5(DVDD) IC8.4(AVDD) IC8.5(DVDD) IC9.4(AVDD) IC9.5(DVDD) IC10.4(AVDD) IC10.5(DVDD) IC11.4(AVDD) IC11.5(DVDD) IC12.4(AVDD) IC12.5(DVDD) IC13.4(AVDD) IC13.5(DVDD) IC14.4(AVDD) IC14.5(DVDD) IC16.4(AVDD) IC16.5(DVDD) IC17.4(AVDD) IC17.5(DVDD) J2.1 J7.1 LDO2.1(IN) LDO2.3(EN) LDO3.1(IN) LDO3.3(EN) LDO4.1(IN) LDO4.3(EN) LDO5.1(IN) LDO5.3(EN) LDO6.1(IN) LDO6.3(EN) LDO7.1(IN) LDO7.3(EN) LDO8.1(IN) LDO8.3(EN) LDO9.1(IN) LDO9.3(EN) LDO10.1(IN) LDO10.3(EN) LDO11.1(IN) LDO11.3(EN) LDO12.1(IN) LDO12.3(EN) LDO13.1(IN) LDO13.3(EN) LDO14.1(IN) LDO14.3(EN) LDO15.1(IN) LDO15.3(EN) LDO16.1(IN) LDO16.3(EN) LDO.1(IN) LDO.3(EN)
DDS1_OUT: R57.1 SJ1.2 SJ2.2
DDS2_OUT: R59.1 SJ6.2 SJ8.2
DDS3_OUT: R70.1 SJ13.2 SJ14.2
DDS4_OUT: R71.1 SJ19.2 SJ20.2
DDS5_OUT: R60.1 SJ25.2 SJ26.2
DDS6_OUT: R69.1 SJ31.2 SJ32.2
DDS7_OUT: R72.1 SJ37.2 SJ38.2
DDS8_OUT: R73.1 SJ43.2 SJ44.2
DDS9_OUT: R74.1 SJ49.2 SJ50.2
DDS10_OUT: R75.1 SJ55.2 SJ56.2
DDS11_OUT: R78.1 SJ61.2 SJ62.2
DDS12_OUT: R79.1 SJ67.2 SJ68.2
DDS13_OUT: R76.1 SJ73.2 SJ74.2
DDS14_OUT: R77.1 SJ91.2 SJ92.2
DDS15_OUT: R80.1 SJ79.2 SJ80.2
DDS16_OUT: R81.1 SJ97.2 SJ98.2
DIN_2_A: J2.12 U3.8(DIN) U8.8(DIN) U17.8(DIN) U20.8(DIN)
DIN_2_B: J4.10 U11.8(DIN) U14.8(DIN) U23.8(DIN) U26.8(DIN)
DIN_2_C: J1.10 U29.8(DIN) U32.8(DIN) U41.8(DIN) U44.8(DIN)
DIN_2_D: J7.12 U35.8(DIN) U38.8(DIN) U47.8(DIN) U50.8(DIN)
FILTER1: C7.1 R3.2 SJ1.1 SJ4.2 SJ5.2
FILTER2: C12.1 R8.2 SJ6.1 SJ11.2 SJ12.2
FILTER3: C18.1 R12.2 SJ13.1 SJ17.2 SJ18.2
FILTER4: C24.1 R16.2 SJ19.1 SJ23.2 SJ24.2
FILTER5: C30.1 R20.2 SJ25.1 SJ29.2 SJ30.2
FILTER6: C36.1 R24.2 SJ31.1 SJ35.2 SJ36.2
FILTER7: C42.1 R28.2 SJ37.1 SJ41.2 SJ42.2
FILTER8: C48.1 R32.2 SJ43.1 SJ47.2 SJ48.2
FILTER9: C54.1 R36.2 SJ49.1 SJ53.2 SJ54.2
FILTER10: C60.1 R40.2 SJ55.1 SJ59.2 SJ60.2
FILTER11: C66.1 R44.2 SJ61.1 SJ65.2 SJ66.2
FILTER12: C72.1 R48.2 SJ67.1 SJ71.2 SJ72.2
FILTER13: C78.1 R52.2 SJ73.1 SJ77.2 SJ78.2
FILTER14: C96.1 R64.2 SJ91.1 SJ95.2 SJ96.2
FILTER15: C84.1 R56.2 SJ79.1 SJ83.2 SJ84.2
FILTER16: C102.1 R68.2 SJ97.1 SJ101.2 SJ102.2
FSELECT_A: IC1.9(FSELECT) IC2.9(FSELECT) IC3.9(FSELECT) IC4.9(FSELECT) J2.3
FSELECT_B: IC5.9(FSELECT) IC6.9(FSELECT) IC7.9(FSELECT) IC8.9(FSELECT) J4.1
FSELECT_C: IC9.9(FSELECT) IC10.9(FSELECT) IC11.9(FSELECT) IC12.9(FSELECT) J1.1
FSELECT_D: IC13.9(FSELECT) IC14.9(FSELECT) IC16.9(FSELECT) IC17.9(FSELECT) J7.3
FSYNC1: IC1.15(FSYNC) J2.5 U3.10(~SYNC)
FSYNC2: IC2.15(FSYNC) J2.8 U8.10(~SYNC)
FSYNC3: IC3.15(FSYNC) J2.7 U17.10(~SYNC)
FSYNC4: IC4.15(FSYNC) J2.10 U20.10(~SYNC)
FSYNC5: IC5.15(FSYNC) J4.3 U11.10(~SYNC)
FSYNC6: IC6.15(FSYNC) J4.6 U14.10(~SYNC)
FSYNC7: IC7.15(FSYNC) J4.5 U23.10(~SYNC)
FSYNC8: IC8.15(FSYNC) J4.8 U26.10(~SYNC)
FSYNC9: IC9.15(FSYNC) J1.3 U29.10(~SYNC)
FSYNC10: IC10.15(FSYNC) J1.6 U32.10(~SYNC)
FSYNC11: IC11.15(FSYNC) J1.5 U41.10(~SYNC)
FSYNC12: IC12.15(FSYNC) J1.8 U44.10(~SYNC)
FSYNC13: IC13.15(FSYNC) J7.5 U35.10(~SYNC)
FSYNC14: IC16.15(FSYNC) J7.8 U38.10(~SYNC)
FSYNC15: IC14.15(FSYNC) J7.7 U47.10(~SYNC)
FSYNC16: IC17.15(FSYNC) J7.10 U50.10(~SYNC)
GND: C1.2 C2.2 C3.2 C4.2 C6.2 C7.2 C8.2 C9.2 C11.2 C12.2 C13.2 C14.2 C15.2 C17.2 C18.2 C19.2 C20.2 C21.2 C23.2 C24.2 C25.2 C26.2 C27.2 C29.2 C30.2 C31.2 C32.2 C33.2 C35.2 C36.2 C37.2 C38.2 C39.2 C41.2 C42.2 C43.2 C44.2 C45.2 C47.2 C48.2 C49.2 C50.2 C51.2 C53.2 C54.2 C55.2 C56.2 C57.2 C59.2 C60.2 C61.2 C62.2 C63.2 C65.2 C66.2 C67.2 C68.2 C69.2 C71.2 C72.2 C73.2 C74.2 C75.2 C77.2 C78.2 C79.2 C80.2 C81.2 C83.2 C84.2 C86.1 C87.1 C89.1 C90.1 C91.2 C92.2 C93.2 C95.2 C96.2 C97.2 C98.2 C99.2 C101.2 C102.2 C104.2 C106.2 C107.2 C113.1 C114.1 C116.1 C117.1 C118.2 C119.2 C120.2 C121.1 C122.1 C124.1 C125.1 C126.2 C127.2 C128.2 C129.1 C130.1 C132.1 C133.1 C134.2 C135.2 C136.2 C137.1 C138.1 C140.1 C141.1 C142.2 C143.2 C144.2 C145.1 C146.1 C148.1 C149.1 C150.2 C151.2 C152.2 C153.1 C154.1 C156.1 C157.1 C158.2 C159.2 C160.2 C161.1 C162.1 C164.1 C165.1 C166.2 C167.2 C168.2 C169.1 C170.1 C172.1 C173.1 C174.2 C175.2 C176.2 C177.1 C178.1 C180.1 C181.1 C182.2 C183.2 C184.2 C185.1 C186.1 C188.1 C189.1 C190.2 C191.2 C192.2 C193.1 C194.1 C196.1 C197.1 C198.2 C199.2 C200.2 C201.1 C202.1 C204.1 C205.1 C206.2 C207.2 C208.2 C209.1 C210.1 C212.1 C213.1 C214.2 C215.2 C216.2 C217.1 C218.1 C220.1 C221.1 C222.2 C223.2 C224.2 C225.1 C226.1 C228.1 C229.1 C230.2 C231.2 C232.2 IC1.7(DGND) IC1.18(AGND) IC2.7(DGND) IC2.18(AGND) IC3.7(DGND) IC3.18(AGND) IC4.7(DGND) IC4.18(AGND) IC5.7(DGND) IC5.18(AGND) IC6.7(DGND) IC6.18(AGND) IC7.7(DGND) IC7.18(AGND) IC8.7(DGND) IC8.18(AGND) IC9.7(DGND) IC9.18(AGND) IC10.7(DGND) IC10.18(AGND) IC11.7(DGND) IC11.18(AGND) IC12.7(DGND) IC12.18(AGND) IC13.7(DGND) IC13.18(AGND) IC14.7(DGND) IC14.18(AGND) IC16.7(DGND) IC16.18(AGND) IC17.7(DGND) IC17.18(AGND) J2.2 J7.2 JP1.2 JP2.2 JP3.2 JP4.2 JP5.2 JP6.2 JP7.2 JP8.2 JP9.2 JP10.2 JP11.2 JP12.2 JP13.2 JP14.2 JP15.2 JP16.2 LDO2.2(GND) LDO3.2(GND) LDO4.2(GND) LDO5.2(GND) LDO6.2(GND) LDO7.2(GND) LDO8.2(GND) LDO9.2(GND) LDO10.2(GND) LDO11.2(GND) LDO12.2(GND) LDO13.2(GND) LDO14.2(GND) LDO15.2(GND) LDO16.2(GND) LDO.2(GND) LSP1.MP LSP2.MP LSP3.MP LSP4.MP LSP5.MP LSP6.MP LSP7.MP LSP8.MP LSP9.MP LSP10.MP LSP11.MP LSP12.MP LSP13.MP LSP14.MP LSP15.MP LSP16.MP LSP17.MP LSP18.MP LSP19.MP LSP20.MP R1.2 R2.2 R4.1 R5.1 R6.1 R7.1 R9.2 R10.1 R11.1 R13.2 R14.1 R15.1 R17.2 R18.1 R19.1 R21.2 R22.1 R23.1 R25.2 R26.1 R27.1 R29.2 R30.1 R31.1 R33.2 R34.1 R35.1 R37.2 R38.1 R39.1 R41.2 R42.1 R43.1 R45.2 R46.1 R47.1 R49.2 R50.1 R51.1 R53.2 R54.1 R55.1 R61.2 R62.1 R63.1 R65.2 R66.1 R67.1 SJ3.1 SJ7.2 SJ9.1 SJ10.2 SJ15.1 SJ16.2 SJ21.1 SJ22.2 SJ27.1 SJ28.2 SJ33.1 SJ34.2 SJ39.1 SJ40.2 SJ45.1 SJ46.2 SJ51.1 SJ52.2 SJ57.1 SJ58.2 SJ63.1 SJ64.2 SJ69.1 SJ70.2 SJ75.1 SJ76.2 SJ81.1 SJ82.2 SJ93.1 SJ94.2 SJ99.1 SJ100.2 U1.4(GND) U2.3(IN+) U3.6(GND) U7.4(GND) U8.6(GND) U9.3(IN+) U10.4(GND) U11.6(GND) U12.3(IN+) U13.4(GND) U14.6(GND) U15.3(IN+) U16.4(GND) U17.6(GND) U18.3(IN+) U19.4(GND) U20.6(GND) U21.3(IN+) U22.4(GND) U23.6(GND) U24.3(IN+) U25.4(GND) U26.6(GND) U27.3(IN+) U28.4(GND) U29.6(GND) U30.3(IN+) U31.4(GND) U32.6(GND) U33.3(IN+) U34.4(GND) U35.6(GND) U36.3(IN+) U37.4(GND) U38.6(GND) U39.3(IN+) U40.4(GND) U41.6(GND) U42.3(IN+) U43.4(GND) U44.6(GND) U45.3(IN+) U46.4(GND) U47.6(GND) U48.3(IN+) U49.4(GND) U50.6(GND) U51.3(IN+)
IOUT1: IC1.19(IOUT) R3.1 R5.2 SJ4.1
IOUT2: IC2.19(IOUT) R7.2 R8.1 SJ11.1
IOUT3: IC3.19(IOUT) R11.2 R12.1 SJ17.1
IOUT4: IC4.19(IOUT) R15.2 R16.1 SJ23.1
IOUT5: IC5.19(IOUT) R19.2 R20.1 SJ29.1
IOUT6: IC6.19(IOUT) R23.2 R24.1 SJ35.1
IOUT7: IC7.19(IOUT) R27.2 R28.1 SJ41.1
IOUT8: IC8.19(IOUT) R31.2 R32.1 SJ47.1
IOUT9: IC9.19(IOUT) R35.2 R36.1 SJ53.1
IOUT10: IC10.19(IOUT) R39.2 R40.1 SJ59.1
IOUT11: IC11.19(IOUT) R43.2 R44.1 SJ65.1
IOUT12: IC12.19(IOUT) R47.2 R48.1 SJ71.1
IOUT13: IC13.19(IOUT) R51.2 R52.1 SJ77.1
IOUT14: IC16.19(IOUT) R63.2 R64.1 SJ95.1
IOUT15: IC14.19(IOUT) R55.2 R56.1 SJ83.1
IOUT16: IC17.19(IOUT) R67.2 R68.1 SJ101.1
IOUTB1: C6.1 IC1.20(IOUTB) R4.2 SJ7.1
IOUTB2: C11.1 IC2.20(IOUTB) R6.2 SJ10.1
IOUTB3: C17.1 IC3.20(IOUTB) R10.2 SJ16.1
IOUTB4: C23.1 IC4.20(IOUTB) R14.2 SJ22.1
IOUTB5: C29.1 IC5.20(IOUTB) R18.2 SJ28.1
IOUTB6: C35.1 IC6.20(IOUTB) R22.2 SJ34.1
IOUTB7: C41.1 IC7.20(IOUTB) R26.2 SJ40.1
IOUTB8: C47.1 IC8.20(IOUTB) R30.2 SJ46.1
IOUTB9: C53.1 IC9.20(IOUTB) R34.2 SJ52.1
IOUTB10: C59.1 IC10.20(IOUTB) R38.2 SJ58.1
IOUTB11: C65.1 IC11.20(IOUTB) R42.2 SJ64.1
IOUTB12: C71.1 IC12.20(IOUTB) R46.2 SJ70.1
IOUTB13: C77.1 IC13.20(IOUTB) R50.2 SJ76.1
IOUTB14: C95.1 IC16.20(IOUTB) R62.2 SJ94.1
IOUTB15: C83.1 IC14.20(IOUTB) R54.2 SJ82.1
IOUTB16: C101.1 IC17.20(IOUTB) R66.2 SJ100.1
MCLK_A: IC1.8(MCLK) IC2.8(MCLK) IC3.8(MCLK) IC4.8(MCLK) J2.6
MCLK_B: IC5.8(MCLK) IC6.8(MCLK) IC7.8(MCLK) IC8.8(MCLK) J4.4
MCLK_C: IC9.8(MCLK) IC10.8(MCLK) IC11.8(MCLK) IC12.8(MCLK) J1.4
MCLK_D: IC13.8(MCLK) IC14.8(MCLK) IC16.8(MCLK) IC17.8(MCLK) J7.6
N$1: C3.1 IC1.6(CAP/2,5V)
N$2: IC1.1(FS_ADJUST) R1.1
N$3: C4.1 IC1.2(REFOUT)
N$4: C5.1 IC1.3(COMP)
N$5: IC1.17(VIN) SJ3.2 SJ5.1
N$6: C8.1 IC2.6(CAP/2,5V)
N$7: IC2.1(FS_ADJUST) R2.1
N$8: C9.1 IC2.2(REFOUT)
N$9: C10.1 IC2.3(COMP)
N$10: IC2.17(VIN) SJ9.2 SJ12.1
N$11: C14.1 IC3.6(CAP/2,5V)
N$12: IC3.1(FS_ADJUST) R9.1
N$13: C15.1 IC3.2(REFOUT)
N$14: C16.1 IC3.3(COMP)
N$15: IC3.17(VIN) SJ15.2 SJ18.1
N$16: C20.1 IC4.6(CAP/2,5V)
N$17: IC4.1(FS_ADJUST) R13.1
N$18: C21.1 IC4.2(REFOUT)
N$19: C22.1 IC4.3(COMP)
N$20: IC4.17(VIN) SJ21.2 SJ24.1
N$21: C26.1 IC5.6(CAP/2,5V)
N$22: IC5.1(FS_ADJUST) R17.1
N$23: C27.1 IC5.2(REFOUT)
N$24: C28.1 IC5.3(COMP)
N$25: IC5.17(VIN) SJ27.2 SJ30.1
N$26: C32.1 IC6.6(CAP/2,5V)
N$27: IC6.1(FS_ADJUST) R21.1
N$28: C33.1 IC6.2(REFOUT)
N$29: C34.1 IC6.3(COMP)
N$30: IC6.17(VIN) SJ33.2 SJ36.1
N$31: C38.1 IC7.6(CAP/2,5V)
N$32: IC7.1(FS_ADJUST) R25.1
N$33: C39.1 IC7.2(REFOUT)
N$34: C40.1 IC7.3(COMP)
N$35: IC7.17(VIN) SJ39.2 SJ42.1
N$36: C44.1 IC8.6(CAP/2,5V)
N$37: IC8.1(FS_ADJUST) R29.1
N$38: C45.1 IC8.2(REFOUT)
N$39: C46.1 IC8.3(COMP)
N$40: IC8.17(VIN) SJ45.2 SJ48.1
N$41: C50.1 IC9.6(CAP/2,5V)
N$42: IC9.1(FS_ADJUST) R33.1
N$43: C51.1 IC9.2(REFOUT)
N$44: C52.1 IC9.3(COMP)
N$45: IC9.17(VIN) SJ51.2 SJ54.1
N$46: C56.1 IC10.6(CAP/2,5V)
N$47: IC10.1(FS_ADJUST) R37.1
N$48: C57.1 IC10.2(REFOUT)
N$49: C58.1 IC10.3(COMP)
N$50: IC10.17(VIN) SJ57.2 SJ60.1
N$51: C62.1 IC11.6(CAP/2,5V)
N$52: IC11.1(FS_ADJUST) R41.1
N$53: C63.1 IC11.2(REFOUT)
N$54: C64.1 IC11.3(COMP)
N$55: IC11.17(VIN) SJ63.2 SJ66.1
N$56: C68.1 IC12.6(CAP/2,5V)
N$57: IC12.1(FS_ADJUST) R45.1
N$58: C69.1 IC12.2(REFOUT)
N$59: C70.1 IC12.3(COMP)
N$60: IC12.17(VIN) SJ69.2 SJ72.1
N$61: C74.1 IC13.6(CAP/2,5V)
N$62: IC13.1(FS_ADJUST) R49.1
N$63: C75.1 IC13.2(REFOUT)
N$64: C76.1 IC13.3(COMP)
N$65: IC13.17(VIN) SJ75.2 SJ78.1
N$66: C80.1 IC14.6(CAP/2,5V)
N$67: IC14.1(FS_ADJUST) R53.1
N$68: C81.1 IC14.2(REFOUT)
N$69: C82.1 IC14.3(COMP)
N$70: IC14.17(VIN) SJ81.2 SJ84.1
N$76: C92.1 IC16.6(CAP/2,5V)
N$77: IC16.1(FS_ADJUST) R61.1
N$78: C93.1 IC16.2(REFOUT)
N$79: C94.1 IC16.3(COMP)
N$80: IC16.17(VIN) SJ93.2 SJ96.1
N$81: C98.1 IC17.6(CAP/2,5V)
N$82: IC17.1(FS_ADJUST) R65.1
N$83: C99.1 IC17.2(REFOUT)
N$84: C100.1 IC17.3(COMP)
N$85: IC17.17(VIN) SJ99.2 SJ102.1
N$100: C88.2 U1.5(CFLY+)
N$101: C88.1 U1.3(CFLY-)
N$103: C107.1 U3.5(EXT_CAP)
N$107: C115.2 U7.5(CFLY+)
N$108: C115.1 U7.3(CFLY-)
N$109: C120.1 U8.5(EXT_CAP)
N$251: C211.2 U43.5(CFLY+)
N$258: C163.2 U25.5(CFLY+)
N$259: C123.2 U10.5(CFLY+)
N$260: C123.1 U10.3(CFLY-)
N$261: C128.1 U11.5(EXT_CAP)
N$262: C131.2 U13.5(CFLY+)
N$263: C131.1 U13.3(CFLY-)
N$264: C136.1 U14.5(EXT_CAP)
N$265: C139.2 U16.5(CFLY+)
N$266: C139.1 U16.3(CFLY-)
N$267: C144.1 U17.5(EXT_CAP)
N$268: C147.2 U19.5(CFLY+)
N$269: C147.1 U19.3(CFLY-)
N$270: C152.1 U20.5(EXT_CAP)
N$271: C155.2 U22.5(CFLY+)
N$272: C155.1 U22.3(CFLY-)
N$273: C160.1 U23.5(EXT_CAP)
N$274: C163.1 U25.3(CFLY-)
N$275: C168.1 U26.5(EXT_CAP)
N$296: C211.1 U43.3(CFLY-)
N$297: C187.2 U34.5(CFLY+)
N$298: C179.2 U31.5(CFLY+)
N$299: C171.2 U28.5(CFLY+)
N$300: C171.1 U28.3(CFLY-)
N$301: C176.1 U29.5(EXT_CAP)
N$302: C179.1 U31.3(CFLY-)
N$303: C184.1 U32.5(EXT_CAP)
N$304: C187.1 U34.3(CFLY-)
N$305: C192.1 U35.5(EXT_CAP)
N$306: C195.2 U37.5(CFLY+)
N$307: C195.1 U37.3(CFLY-)
N$308: C200.1 U38.5(EXT_CAP)
N$309: C203.2 U40.5(CFLY+)
N$310: C203.1 U40.3(CFLY-)
N$311: C208.1 U41.5(EXT_CAP)
N$312: C216.1 U44.5(EXT_CAP)
N$313: C219.2 U46.5(CFLY+)
N$314: C219.1 U46.3(CFLY-)
N$315: C224.1 U47.5(EXT_CAP)
N$316: C227.2 U49.5(CFLY+)
N$317: C227.1 U49.3(CFLY-)
N$318: C232.1 U50.5(EXT_CAP)
POT_A_1: R57.2 U2.4(IN-) U3.2(A)
POT_A_2: R59.2 U8.2(A) U9.4(IN-)
POT_A_3: R70.2 U17.2(A) U18.4(IN-)
POT_A_4: R71.2 U20.2(A) U21.4(IN-)
POT_A_5: R60.2 U11.2(A) U12.4(IN-)
POT_A_6: R69.2 U14.2(A) U15.4(IN-)
POT_A_7: R72.2 U23.2(A) U24.4(IN-)
POT_A_8: R73.2 U26.2(A) U27.4(IN-)
POT_A_9: R74.2 U29.2(A) U30.4(IN-)
POT_A_10: R75.2 U32.2(A) U33.4(IN-)
POT_A_11: R78.2 U41.2(A) U42.4(IN-)
POT_A_12: R79.2 U44.2(A) U45.4(IN-)
POT_A_13: R76.2 U35.2(A) U36.4(IN-)
POT_A_14: R77.2 U38.2(A) U39.4(IN-)
POT_A_15: R80.2 U47.2(A) U48.4(IN-)
POT_A_16: R81.2 U50.2(A) U51.4(IN-)
POT_W_1: JP3.1 U2.1(OUT) U3.3(W)
POT_W_2: JP4.1 U8.3(W) U9.1(OUT)
POT_W_3: JP6.1 U17.3(W) U18.1(OUT)
POT_W_4: JP7.1 U20.3(W) U21.1(OUT)
POT_W_5: JP1.1 U11.3(W) U12.1(OUT)
POT_W_6: JP2.1 U14.3(W) U15.1(OUT)
POT_W_7: JP5.1 U23.3(W) U24.1(OUT)
POT_W_8: JP8.1 U26.3(W) U27.1(OUT)
POT_W_9: JP9.1 U29.3(W) U30.1(OUT)
POT_W_10: JP10.1 U32.3(W) U33.1(OUT)
POT_W_11: JP11.1 U41.3(W) U42.1(OUT)
POT_W_12: JP12.1 U44.3(W) U45.1(OUT)
POT_W_13: JP13.1 U35.3(W) U36.1(OUT)
POT_W_14: JP14.1 U38.3(W) U39.1(OUT)
POT_W_15: JP15.1 U47.3(W) U48.1(OUT)
POT_W_16: JP16.1 U50.3(W) U51.1(OUT)
PSELECT_A: IC1.10(PSELECT) IC2.10(PSELECT) IC3.10(PSELECT) IC4.10(PSELECT) J2.4
PSELECT_B: IC5.10(PSELECT) IC6.10(PSELECT) IC7.10(PSELECT) IC8.10(PSELECT) J4.2
PSELECT_C: IC9.10(PSELECT) IC10.10(PSELECT) IC11.10(PSELECT) IC12.10(PSELECT) J1.2
PSELECT_D: IC13.10(PSELECT) IC14.10(PSELECT) IC16.10(PSELECT) IC17.10(PSELECT) J7.4
RESET_A: IC1.11(RESET) IC2.11(RESET) IC3.11(RESET) IC4.11(RESET) J2.16
RESET_B: IC5.11(RESET) IC6.11(RESET) IC7.11(RESET) IC8.11(RESET) J4.14
RESET_C: IC9.11(RESET) IC10.11(RESET) IC11.11(RESET) IC12.11(RESET) J1.14
RESET_D: IC13.11(RESET) IC14.11(RESET) IC16.11(RESET) IC17.11(RESET) J7.16
SCLK2_A: J2.11 U3.9(SCLK) U8.9(SCLK) U17.9(SCLK) U20.9(SCLK)
SCLK2_B: J4.9 U11.9(SCLK) U14.9(SCLK) U23.9(SCLK) U26.9(SCLK)
SCLK2_C: J1.9 U29.9(SCLK) U32.9(SCLK) U41.9(SCLK) U44.9(SCLK)
SCLK2_D: J7.11 U35.9(SCLK) U38.9(SCLK) U47.9(SCLK) U50.9(SCLK)
SCLK_1_A: IC1.14(SCLK) IC2.14(SCLK) IC3.14(SCLK) IC4.14(SCLK) J2.13
SCLK_1_B: IC5.14(SCLK) IC6.14(SCLK) IC7.14(SCLK) IC8.14(SCLK) J4.11
SCLK_1_C: IC9.14(SCLK) IC10.14(SCLK) IC11.14(SCLK) IC12.14(SCLK) J1.11
SCLK_1_D: IC13.14(SCLK) IC14.14(SCLK) IC16.14(SCLK) IC17.14(SCLK) J7.13
SDATA_1_A: IC1.13(SDATA) IC2.13(SDATA) IC3.13(SDATA) IC4.13(SDATA) J2.14
SDATA_1_B: IC5.13(SDATA) IC6.13(SDATA) IC7.13(SDATA) IC8.13(SDATA) J4.12
SDATA_1_C: IC9.13(SDATA) IC10.13(SDATA) IC11.13(SDATA) IC12.13(SDATA) J1.12
SDATA_1_D: IC13.13(SDATA) IC14.13(SDATA) IC16.13(SDATA) IC17.13(SDATA) J7.14
SDO_2_A: J2.9 U3.7(SDO) U8.7(SDO) U17.7(SDO) U20.7(SDO)
SDO_2_B: J4.7 U11.7(SDO) U14.7(SDO) U23.7(SDO) U26.7(SDO)
SDO_2_C: J1.7 U29.7(SDO) U32.7(SDO) U41.7(SDO) U44.7(SDO)
SDO_2_D: J7.9 U35.7(SDO) U38.7(SDO) U47.7(SDO) U50.7(SDO)
SIGN_BIT_OUT1: IC1.16(SIGN_BIT_OUT) SJ2.1
SIGN_BIT_OUT2: IC2.16(SIGN_BIT_OUT) SJ8.1
SIGN_BIT_OUT3: IC3.16(SIGN_BIT_OUT) SJ14.1
SIGN_BIT_OUT4: IC4.16(SIGN_BIT_OUT) SJ20.1
SIGN_BIT_OUT5: IC5.16(SIGN_BIT_OUT) SJ26.1
SIGN_BIT_OUT6: IC6.16(SIGN_BIT_OUT) SJ32.1
SIGN_BIT_OUT7: IC7.16(SIGN_BIT_OUT) SJ38.1
SIGN_BIT_OUT8: IC8.16(SIGN_BIT_OUT) SJ44.1
SIGN_BIT_OUT9: IC9.16(SIGN_BIT_OUT) SJ50.1
SIGN_BIT_OUT10: IC10.16(SIGN_BIT_OUT) SJ56.1
SIGN_BIT_OUT11: IC11.16(SIGN_BIT_OUT) SJ62.1
SIGN_BIT_OUT12: IC12.16(SIGN_BIT_OUT) SJ68.1
SIGN_BIT_OUT13: IC13.16(SIGN_BIT_OUT) SJ74.1
SIGN_BIT_OUT14: IC16.16(SIGN_BIT_OUT) SJ92.1
SIGN_BIT_OUT15: IC14.16(SIGN_BIT_OUT) SJ80.1
SIGN_BIT_OUT16: IC17.16(SIGN_BIT_OUT) SJ98.1
SLEEP_A: IC1.12(SLEEP) IC2.12(SLEEP) IC3.12(SLEEP) IC4.12(SLEEP) J2.15
SLEEP_B: IC5.12(SLEEP) IC6.12(SLEEP) IC7.12(SLEEP) IC8.12(SLEEP) J4.13
SLEEP_C: IC9.12(SLEEP) IC10.12(SLEEP) IC11.12(SLEEP) IC12.12(SLEEP) J1.13
SLEEP_D: IC13.12(SLEEP) IC14.12(SLEEP) IC16.12(SLEEP) IC17.12(SLEEP) J7.15
VNEG_1: C90.2 C106.1 U1.1(OUT) U2.2(GND) U3.4(VSS)
VNEG_2: C117.2 C119.1 U7.1(OUT) U8.4(VSS) U9.2(GND)
VNEG_3: C141.2 C143.1 U16.1(OUT) U17.4(VSS) U18.2(GND)
VNEG_4: C149.2 C151.1 U19.1(OUT) U20.4(VSS) U21.2(GND)
VNEG_5: C125.2 C127.1 U10.1(OUT) U11.4(VSS) U12.2(GND)
VNEG_6: C133.2 C135.1 U13.1(OUT) U14.4(VSS) U15.2(GND)
VNEG_7: C157.2 C159.1 U22.1(OUT) U23.4(VSS) U24.2(GND)
VNEG_8: C165.2 C167.1 U25.1(OUT) U26.4(VSS) U27.2(GND)
VNEG_9: C173.2 C175.1 U28.1(OUT) U29.4(VSS) U30.2(GND)
VNEG_10: C181.2 C183.1 U31.1(OUT) U32.4(VSS) U33.2(GND)
VNEG_11: C205.2 C207.1 U40.1(OUT) U41.4(VSS) U42.2(GND)
VNEG_12: C213.2 C215.1 U43.1(OUT) U44.4(VSS) U45.2(GND)
VNEG_13: C189.2 C191.1 U34.1(OUT) U35.4(VSS) U36.2(GND)
VNEG_14: C197.2 C199.1 U37.1(OUT) U38.4(VSS) U39.2(GND)
VNEG_15: C221.2 C223.1 U46.1(OUT) U47.4(VSS) U48.2(GND)
VNEG_16: C229.2 C231.1 U49.1(OUT) U50.4(VSS) U51.2(GND)

## Notes on the sheet
- Digital Signal Processing (DSP) board
- Direct Digital Synthesizer (DDS) stages | Variable Gain Amplifier (VGA) stages
- Connections to signal distribution board (part of controller board)

## Library data of the parts
C1-C84 C86-C102 C104 C106 C107 C113-C232 = rcl:C-EU: CAPACITOR, European symbol; SPICEPREFIX: C
H1 H2 = holes:MOUNT-HOLE: MOUNTING HOLE with drill center marker
IC1-IC14 IC16 IC17 = AD9834:AD9834: Low Power Complete DDS Clock Rate up to 75 MHz Serial Interface; AVAILABILITY: Unavailable; DESCRIPTION: Direct Digital Synthesis IC 10 b 50MHz 28 b Tuning 20-TSSOP; MF: Analog Devices; MP: AD9834; PACKAGE: TSSOP-20 Analog Devices; PRICE: None
J1 J4 = 61301621021_Eagle_WR-PHD_rev19a:6130XX21021_61301421021: WR-PHD 2.54 mm THT Angled Dual Pin Header ARTICLE PROPERTIES: Pins:4;​ 6;​ 8;​ 10;​ 12;​ 14;​ 16;​ 18;​ 20;​ 22;​ 24;​ 26;​ 32;​ 34;​ 36;​ 40;​ 64;​ 72 KIND PROPERTIES: Pitch：2.54 mm Quality Class:3 as per CECC 75 301-802 Rows：Dual Gender：Pin Header Type：Angled;​ Board Stacker MATERIAL PROPERTIES: Insulator Material :PA6T Insulator Flammability Rating:UL94 V-0 Contact Material:Copper Alloy Contact Plating:Gold Contact Type:Stamped GENERAL INFORMATION Operating Temperature:-40 up to +105 °C Compliance:RoHS ELECTRICAL PROPERTIES: Rated Current:3 A IR 1:3 A Withstanding Voltage:500 V (AC) Contact Resistance:20 mΩ RISO:1000 MΩ CERTIFICATION UL Approval:E323964 PACKAGING PROPERTIES Packaging:Bag <https://katalog.we-online.com/media/images/v2/o33214v209%20Family_wr-phd_6130XX21021.jpg> Details see: https://katalog.we-online.com/en/em/PHD_2_54_THT_ANGLED_DUAL_PIN_HEADER_6130XX21021 Updated by Yingchun,Shan 2019-10-16 2019 (C) Würth Elektronik; DATASHEET-URL: https://katalog.we-online.com/em/datasheet/61301421021.pdf; GENDER: Pin Header; IR: 3A; MATES: WR-PHD 2.54mm Angled DualSocket Header/Dual Socket Header/Dual Socket Header Bottom Entry/Dual Socket Header Bottom Entry Large/SMT Dual Socket Header/SMT Dual Socket Header Bottom Entry; PACKAGING: Bag; PART-NUMBER: 61301421021; PINS: 14; ROWS: Dual; TYPE: Angled
J2 J7 = 61301421021_Eagle_WR-PHD_rev19a:6130XX21021_61301621021: WR-PHD 2.54 mm THT Angled Dual Pin Header ARTICLE PROPERTIES: Pins:4;​ 6;​ 8;​ 10;​ 12;​ 14;​ 16;​ 18;​ 20;​ 22;​ 24;​ 26;​ 32;​ 34;​ 36;​ 40;​ 64;​ 72 KIND PROPERTIES: Pitch：2.54 mm Quality Class:3 as per CECC 75 301-802 Rows：Dual Gender：Pin Header Type：Angled;​ Board Stacker MATERIAL PROPERTIES: Insulator Material :PA6T Insulator Flammability Rating:UL94 V-0 Contact Material:Copper Alloy Contact Plating:Gold Contact Type:Stamped GENERAL INFORMATION Operating Temperature:-40 up to +105 °C Compliance:RoHS ELECTRICAL PROPERTIES: Rated Current:3 A IR 1:3 A Withstanding Voltage:500 V (AC) Contact Resistance:20 mΩ RISO:1000 MΩ CERTIFICATION UL Approval:E323964 PACKAGING PROPERTIES Packaging:Bag <https://katalog.we-online.com/media/images/v2/o33214v209%20Family_wr-phd_6130XX21021.jpg> Details see: https://katalog.we-online.com/en/em/PHD_2_54_THT_ANGLED_DUAL_PIN_HEADER_6130XX21021 Updated by Yingchun,Shan 2019-10-16 2019 (C) Würth Elektronik; DATASHEET-URL: https://katalog.we-online.com/em/datasheet/61301621021.pdf; GENDER: Pin Header; IR: 3A; MATES: WR-PHD 2.54mm Angled DualSocket Header/Dual Socket Header/Dual Socket Header Bottom Entry/Dual Socket Header Bottom Entry Large/SMT Dual Socket Header/SMT Dual Socket Header Bottom Entry; PACKAGING: Bag; PART-NUMBER: 61301621021; PINS: 16; ROWS: Dual; TYPE: Angled
JP1-JP16 = pinhead:PINHD-1X2: PIN HEADER
LDO LDO2-LDO16 = SOT95P280X145-5N:TLV75525PDBVR
LSP1-LSP20 = solpad:LSP10: SOLDER PAD drill 1.0 mm, distributor Buerklin, 12H555
R1-R57 R59-R81 = rcl:R-EU_: RESISTOR, European symbol; SPICEPREFIX: R
SJ1-SJ84 SJ91-SJ102 = jumper:SJ: SMD solder JUMPER
U1 U7 U10 U13 U16 U19 U22 U25 U28 U31 U34 U37 U40 U43 U46 U49 = TPS60400DBVT:TPS60400DBVT: Unregulated 60mA charge pump Voltage Inverter; AVAILABILITY: Unavailable; DESCRIPTION: Charge Pump Switching Regulator IC Positive or Negative Fixed -Vin, 2Vin, Vin/2 1 Output 60mA SC-74A, SOT-753; MF: Texas Instruments; MP: TPS60400DBVT; PACKAGE: SOT-23-5 Texas Instruments; PRICE: None
U2 U9 U12 U15 U18 U21 U24 U27 U30 U33 U36 U39 U42 U45 U48 U51 = TLV271CDBVR:TLV271CDBVR: OPERATIONAL AMPLIFIERS; AVAILABILITY: Unavailable; DESCRIPTION: CMOS Amplifier 1 Circuit Rail-to-Rail SOT-23-5; MF: Texas Instruments; MP: TLV271CDBVR; PACKAGE: SOT-23-5 Texas Instruments; PRICE: None
U3 U8 U11 U14 U17 U20 U23 U26 U29 U32 U35 U38 U41 U44 U47 U50 = AD5270BRMZ-50:AD5270BRMZ-50: 1024-/256-Position, 1% Resistor Tolerance Error, SPI Interface and 50-TP Memory Digital Rheostat; AVAILABILITY: Unavailable; DESCRIPTION: Digital Potentiometer 50k Ohm 1 Circuit 1024 Taps SPI Interface 10-MSOP; MF: Analog Devices; MP: AD5270BRMZ-50; PACKAGE: MSOP-10 Analog Devices; PRICE: None